# EAGLE board electrobassrev9_fix (EAGLE 9.6.2), part 1 of 2
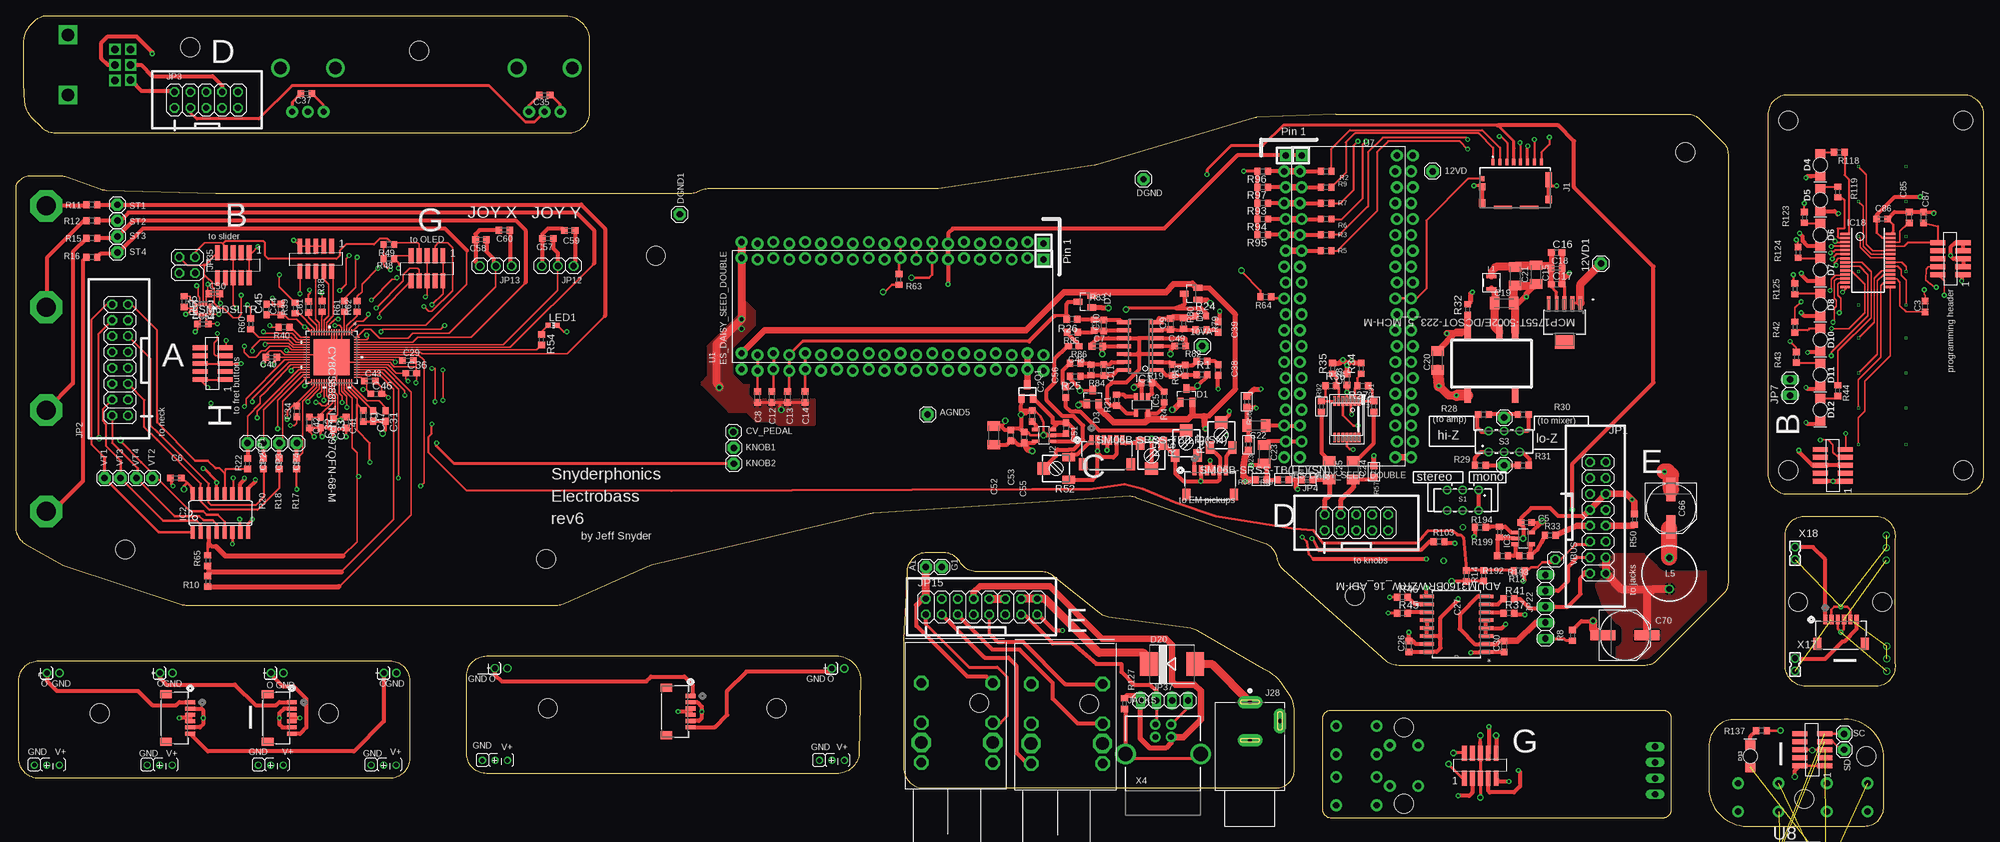
[diagram p12: board, top side]
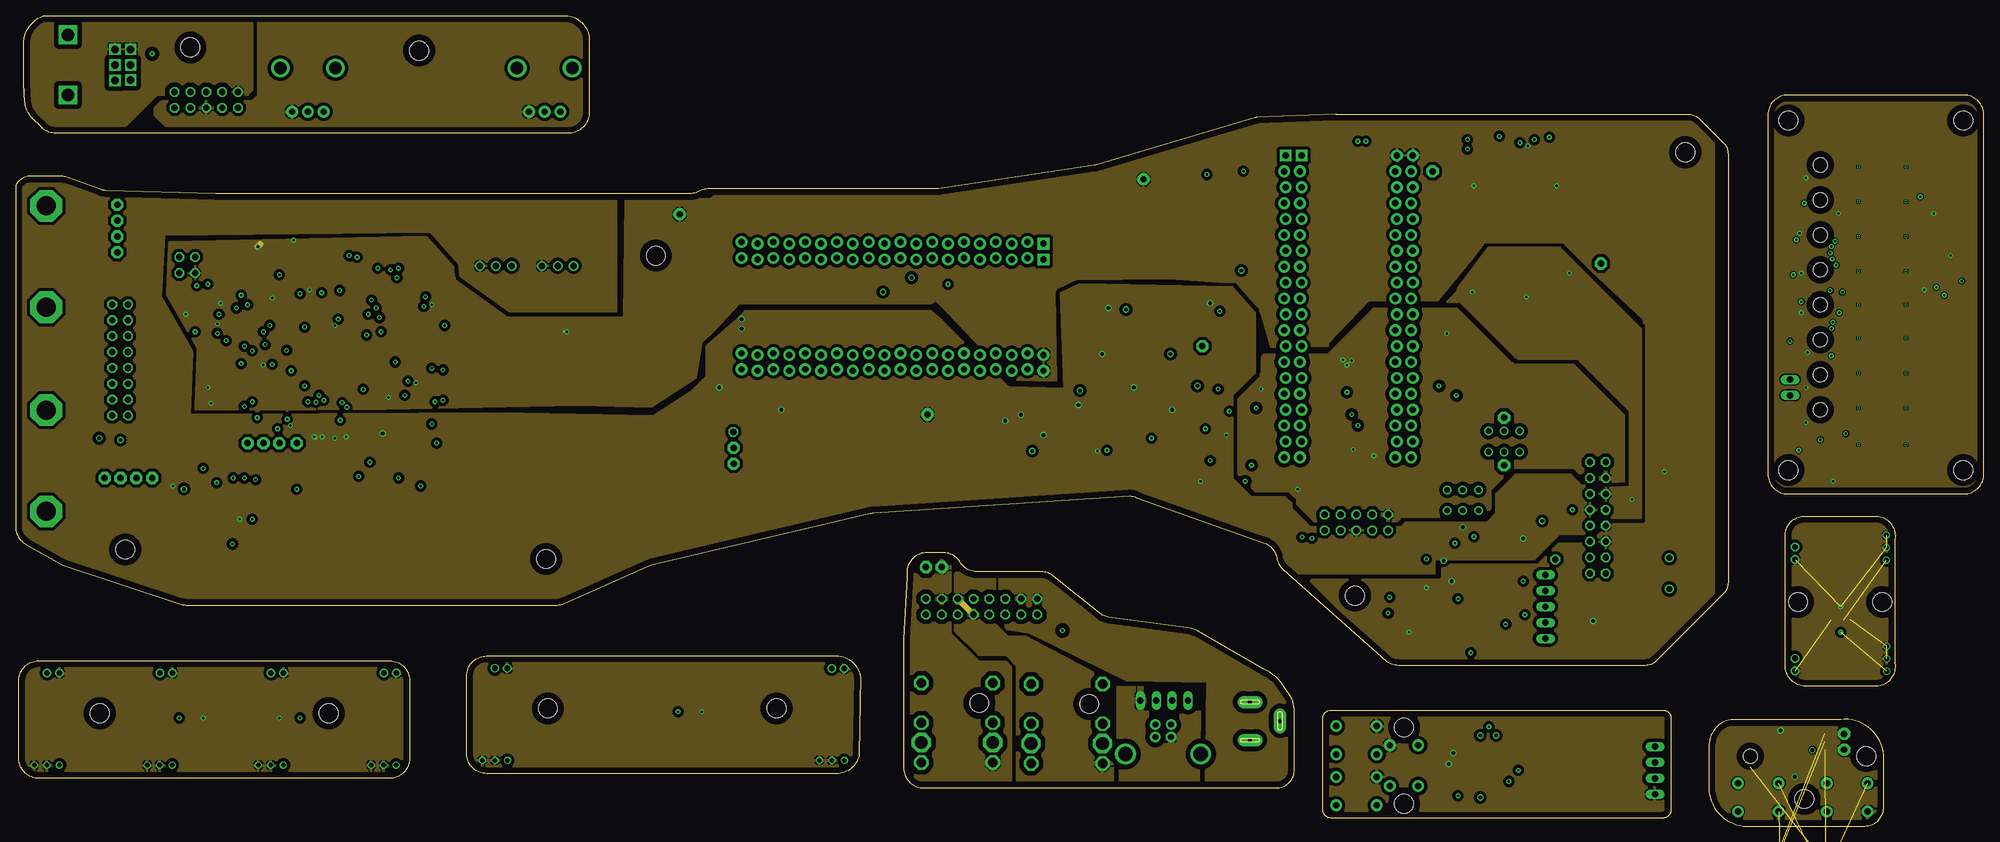
[diagram p13: board, inner layer Route2]
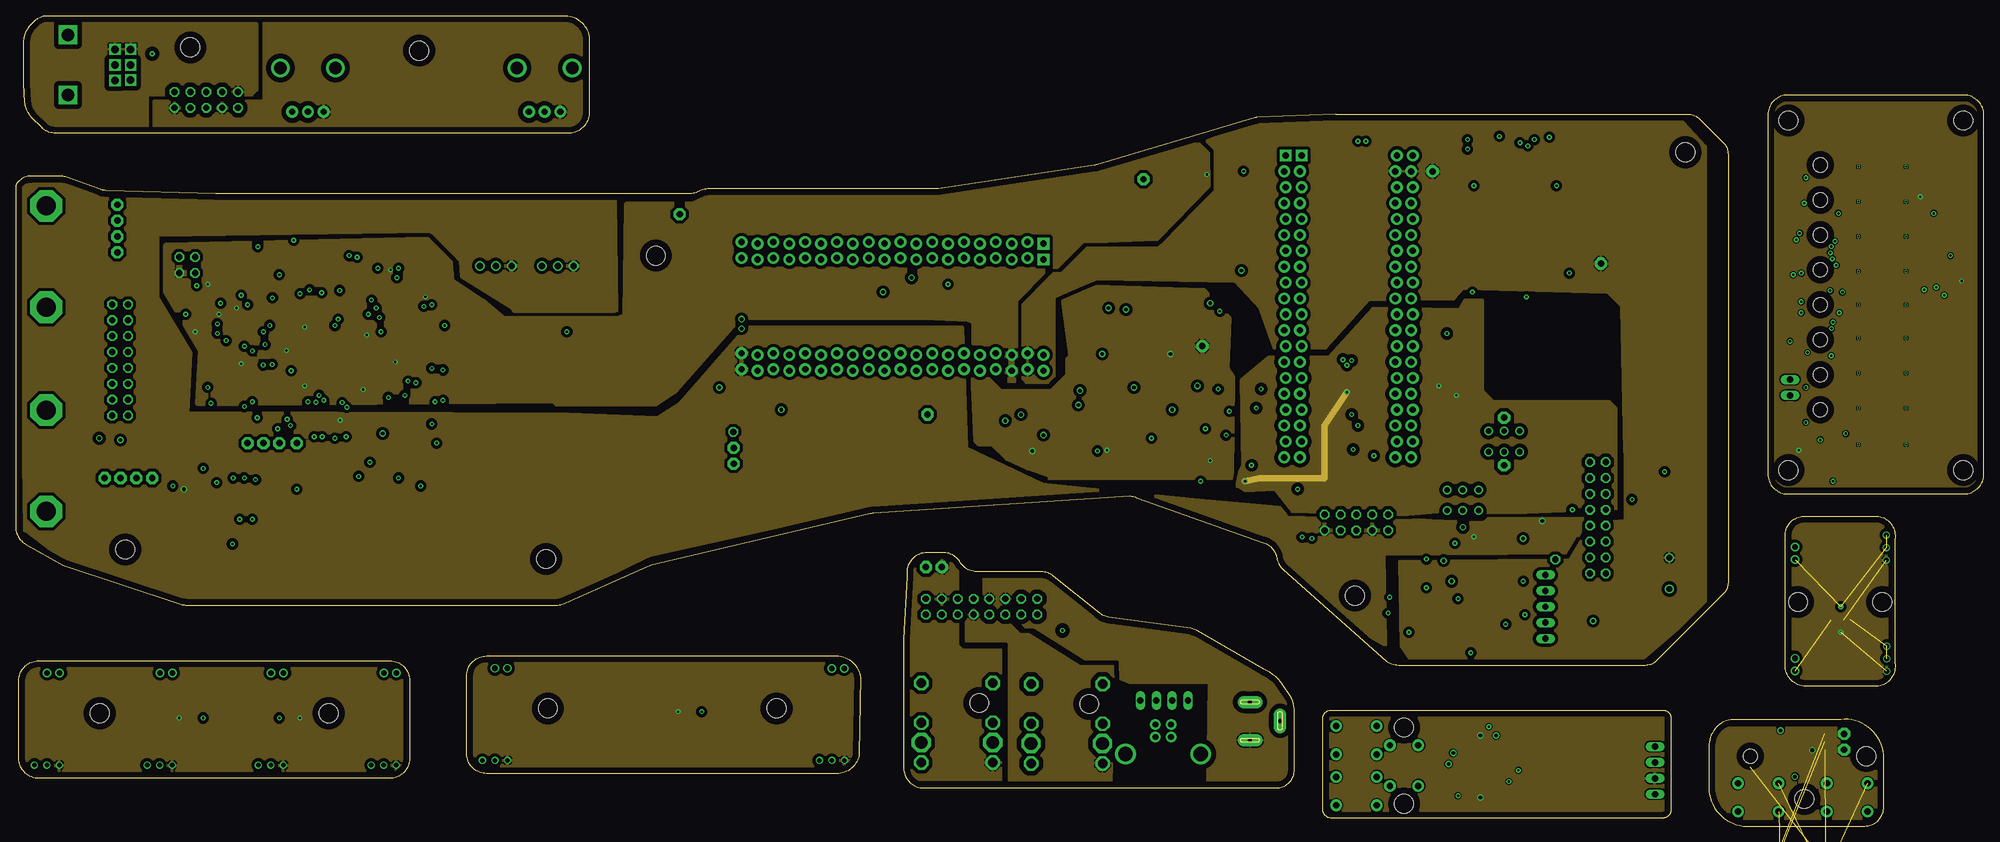
[diagram p14: board, inner layer Route15]
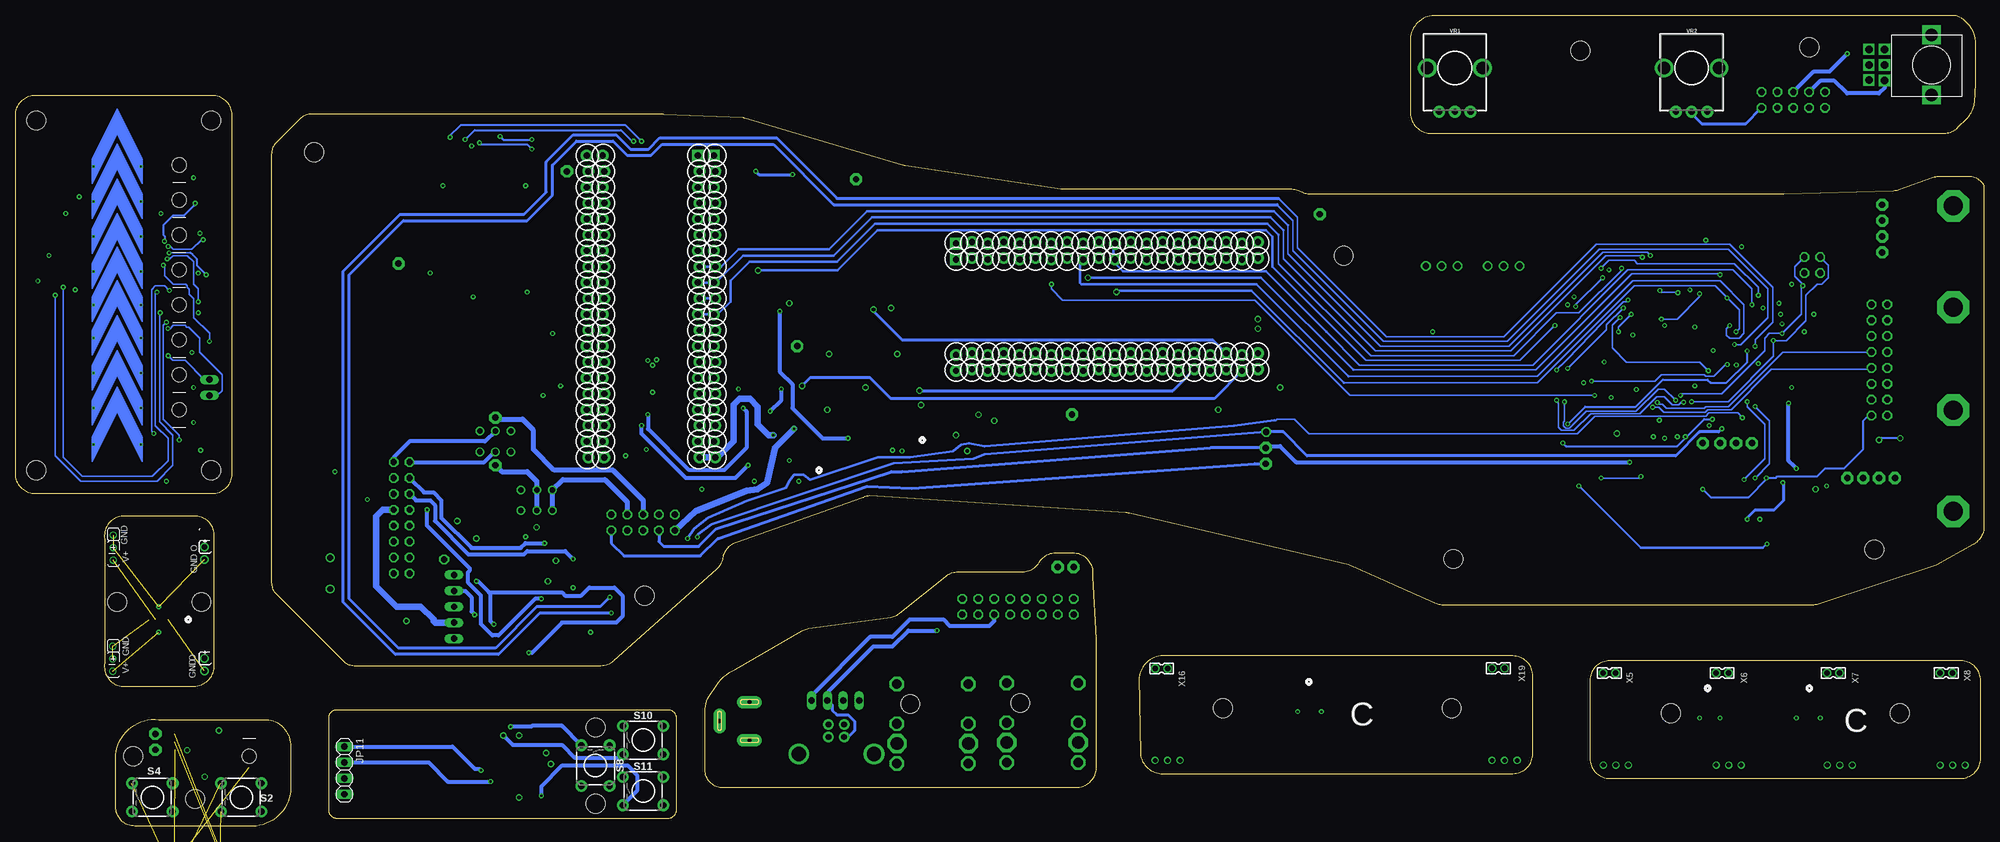
[diagram p15: board, bottom side, seen from below]

Size 314.71 x 129.54 mm. Coordinates in mm from the lower left corner, seen from the top.
Outline: 0,102.36 0,47.82 arc60 1.61,45.06 7.62,41.66 26.44,35.46 arc18 27.43,35.31 86.45,35.31 arc24 87.74,35.58 101.07,41.53 arc-11 101.64,41.73 136.64,49.98 arc-10 137.18,50.05 178.16,52.79 arc-23 179.43,52.36 199.52,45.28 arc-58 201.56,43.26 201.7,42.64 arc35 202.69,40.98 219.06,26.45 arc42 221.17,25.65 260.57,25.65 arc45 262.36,26.4 273.07,37.1 arc45 273.81,38.9 273.81,107.41 arc45 273.07,109.2 269.22,113.05 arc45 267.43,113.79 211.07,113.79 198.37,113.28 arc-9 198.13,113.21 172.93,105.73 arc-8 172.5,105.63 147.55,101.89 arc-9 147.08,101.85 110.89,101.85 arc23 109.64,101.6 109.06,101.35 arc-23 107.81,101.09 32,101.09 14.48,101.59 arc-18 13.49,101.77 8.14,103.7 arc20 7.07,103.89 2.47,103.89 arc63 0,102.36
Outline: 311.53,116.84 283.34,116.84 arc90 280.16,113.66 280.16,56.26 arc90 283.34,53.09 311.53,53.09 arc90 314.71,56.26 314.71,113.66 arc90 311.53,116.84
Outline: 291.85,17.02 275,17.02 arc90 270.76,13.03 270.76,6.78 arc90 276.27,0 295.66,0 arc90 298.7,3.05 298.7,11.43 arc90 291.85,17.02
Outline: 4.62,129.52 88.27,129.54 arc-90 91.69,125.09 91.69,113.92 arc-90 88.27,110.74 6.39,110.74 arc-45 4.15,111.67 2.65,113.17 arc-18 2.06,114 1.81,114.5 arc-22 1.48,115.69 1.27,118.62 1.27,125.03 arc-70 4.38,129.49 4.53,129.53 arc-20 4.62,129.52
Outline: 210.31,18.54 263.4,18.54 arc-90 264.67,17.27 264.67,2.54 arc-90 263.4,1.27 210.31,1.27 arc-90 209.04,2.54 209.04,17.27 arc-90 210.31,18.54
Outline: 142.49,39.88 141.99,29.97 141.99,9.27 arc90 145.16,6.1 201.8,6.1 arc90 204.47,9.27 204.47,18.27 arc28 203.85,20.76 202.63,22.52 arc34 199.56,25.1 188.98,31.21 arc21 187.89,31.57 175.26,33.27 174.75,33.38 arc-27 173.39,34.01 165.97,39.94 arc39 163.99,40.64 153.72,40.64 arc-60 150.97,42.22 arc60 148.41,43.69 145.67,43.69 arc90 142.49,40.51 142.49,39.88
Outline: 130.94,8.38 75.31,8.38 arc-90 72.14,11.56 72.14,24 arc-90 75.31,27.18 130.43,27.18 arc-90 135.13,23.75 134.87,11.56 arc-90 130.94,8.38
Outline: 282.96,26.03 282.96,46.36 arc-90 285.88,49.53 297.81,49.53 arc-90 300.48,45.85 300.48,26.03 arc-90 297.81,22.35 285.88,22.35 arc-90 282.96,26.03
Outline: 59.82,7.62 3.68,7.62 arc-90 0.51,10.79 0.51,23.24 arc-90 3.68,26.42 59.82,26.42 arc-90 62.99,23.24 62.99,10.79 arc-90 59.82,7.62
Copper layers (1+2*15+16): Top 0.035mm / dielectric 1.5mm / Route2 0.035mm / dielectric 0.15mm / Route15 0.035mm / dielectric 0.2mm / Bottom 0.035mm
Design rules "default *": minimum track width 8mil, minimum drill 12mil, track to track 7mil, track to pad 7mil, pad to pad 7mil, via to via 7mil, smd to smd 7mil, copper to edge 40mil, drill to drill 8mil, minimum pad ring 1mil, minimum via ring 8mil, stop-mask expansion 1mil, vias tented up to drill 0mil, thermal gap 10mil
Holes 3.05 mm at 84.84,42.67 17.53,44.2 102.36,91.19 214.12,36.83 266.95,107.7 311.4,112.78 311.4,56.9 283.46,56.9 283.46,112.78 286,4.32 295.91,11.18 64.52,123.95 27.94,124.46 222,15.75 222,3.56 85.09,18.8 121.67,18.8 298.45,35.81 284.99,35.81 13.46,18.03 50.04,18.03

## Footprints (pad centres in the part's own frame; a part is rotated, then mirrored left to right if it is on the bottom)
1X01 = drill 1.016 pad 1.93 octagon: 1 0,0
C0603K = smd 1.05 x 1.08: 1 -0.875,0; 2 0.875,0
C1206K = smd 1.5 x 2: 1 -1.5,0; 2 1.5,0
C0603 = smd 1.1 x 1: 1 -0.85,0; 2 0.85,0
PANASONIC_E = smd 3.8 x 1.4: + 3,0; - -3,0
PANASONIC_F = smd 4 x 1.6: + 3.55,0; - -3.55,0
1X01' = drill 1.016 octagon: 1 0,0
SOT23 = smd 1 x 1.4: 1 -0.95,-1.1; 2 0.95,-1.1; 3 0,1.1
LED-1206-BOTTOM = smd 1.5 x 1.6: A -1.8,0; C 1.8,0 | hole 2.3: 0,0
SMC = smd 2.8 x 3.8: A 3.7,0; C -3.7,0
SO14 = smd 0.6 x 2.2: 1 -3.81,-2.6; 2 -2.54,-2.6; 3 -1.27,-2.6; 4 0,-2.6; 5 1.27,-2.6; 6 2.54,-2.6; 7 3.81,-2.6; 8 3.81,2.6; 9 2.54,2.6; 10 1.27,2.6; 11 0,2.6; 12 -1.27,2.6; 13 -2.54,2.6; 14 -3.81,2.6
SO16 = smd 0.66 x 2.032: 1 -4.445,-3.073; 2 -3.175,-3.073; 3 -1.905,-3.073; 4 -0.635,-3.073; 5 0.635,-3.073; 6 1.905,-3.073; 7 3.175,-3.073; 8 4.445,-3.073; 9 4.445,3.073; 10 3.175,3.073; 11 1.905,3.073; 12 0.635,3.073; 13 -0.635,3.073; 14 -1.905,3.073; 15 -3.175,3.073; 16 -4.445,3.073
SOT23-5 = smd 0.6 x 1.2: 1 -0.95,-1.306; 2 0,-1.306; 3 0.95,-1.306; 4 0.95,1.306; 5 -0.95,1.306
SSOP28 = smd 0.4 x 1.5: 1 -4.225,-3.625; 2 -3.575,-3.625; 3 -2.925,-3.625; 4 -2.275,-3.625; 5 -1.625,-3.625; 6 -0.975,-3.625; 7 -0.325,-3.625; 8 0.325,-3.625; 9 0.975,-3.625; 10 1.625,-3.625; 11 2.275,-3.625; 12 2.925,-3.625; 13 3.575,-3.625; 14 4.225,-3.625; 15 4.225,3.625; 16 3.575,3.625; 17 2.925,3.625; 18 2.275,3.625; 19 1.625,3.625; 20 0.975,3.625; 21 0.325,3.625; 22 -0.325,3.625; 23 -0.975,3.625; 24 -1.625,3.625; 25 -2.275,3.625; 26 -2.925,3.625; 27 -3.575,3.625; 28 -4.225,3.625
105162-0001 = smd 0.5 x 1: 1 3.55,-7.34; 2 2.45,-7.34; 3 1.35,-7.34; 4 0.25,-7.34; 5 -0.85,-7.34; 6 -1.95,-7.34; 7 -3.05,-7.34; 8 -4.15,-7.34 | smd 0.72 x 0.78: 9 5.31,-4.66 | smd 1.05 x 1.08: 10 5.325,-3.39 | smd 1.05 x 1.2: 11 5.325,-0.78; 12 -5.325,-1.35 | smd 1.05 x 2.39: 13 -5.325,-4.535 | smd 2.91 x 0.55: 14 1.986,-0.105; 15 -2.204,-0.105
CONN_SM06B-SRSS-TB_JST = smd 0.66 x 1.549: 1 -2.5,2.507; 2 -1.5,2.507; 3 -0.5,2.507; 4 0.5,2.507; 5 1.5,2.507; 6 2.5,2.507 | smd 1.295 x 1.905: 7 -3.8,-1.368; 8 3.8,-1.368
CUI_PJ-066A = drill 0.7 pad 2 long: 1 0,0; 2 6.1,0; 3 3,4.8
2X08 = drill 1.016 octagon: 1 -8.89,-1.27; 2 -8.89,1.27; 3 -6.35,-1.27; 4 -6.35,1.27; 5 -3.81,-1.27; 6 -3.81,1.27; 7 -1.27,-1.27; 8 -1.27,1.27; 9 1.27,-1.27; 10 1.27,1.27; 11 3.81,-1.27; 12 3.81,1.27; 13 6.35,-1.27; 14 6.35,1.27; 15 8.89,-1.27; 16 8.89,1.27
2X05 = drill 1.016 octagon: 1 -5.08,-1.27; 2 -5.08,1.27; 3 -2.54,-1.27; 4 -2.54,1.27; 5 0,-1.27; 6 0,1.27; 7 2.54,-1.27; 8 2.54,1.27; 9 5.08,-1.27; 10 5.08,1.27
20021121 = smd 0.76 x 2.4: 1 -2.54,-2; 2 -2.54,2; 3 -1.27,-2; 4 -1.27,2; 5 0,-2; 6 0,2; 7 1.27,-2; 8 1.27,2; 9 2.54,-2; 10 2.54,2
1X02 = drill 1.016 long: 1 -1.27,0; 2 1.27,0
1X04 = drill 1.016 long: 1 -3.81,0; 2 -1.27,0; 3 1.27,0; 4 3.81,0
1X03 = drill 1.016: 1 -2.54,0; 2 0,0; 3 2.54,0
1X05 = drill 1.016 long: 1 -5.08,0; 2 -2.54,0; 3 0,0; 4 2.54,0; 5 5.08,0
2X02 = drill 1.016 octagon: 1 -1.27,-1.27; 2 -1.27,1.27; 3 1.27,-1.27; 4 1.27,1.27
BOURNS_SRP2010 = smd 0.559 x 1.6: P$1 -1.003,0; P$2 1.003,0
6000-XXXX-RC = drill 0.9 pad 1.422: 1 -2.5,0; 2 2.5,0
CHIP-LED0603 = smd 0.8 x 0.8: A 0,-0.75; C 0,0.75
SUPER-SOT3 = smd 1 x 1.4: 1 -0.95,-1.1; 2 0.95,-1.1; 3 0,1.1
R0603 = smd 1 x 1.1: 1 -0.85,0; 2 0.85,0
RTRIM3314J = smd 1.3 x 2: 1 1.8,-2; 3 -1.8,-2 | smd 2 x 2: 2 0,2
452404020202 = drill 0.9: 1 2.5,1.65; 2 0,1.65; 3 -2.5,1.65; 4 2.5,-1.65; 5 0,-1.65; 6 -2.5,-1.65
TACTILE_SWITCH_PTH_6.0MM = drill 1.016 pad 1.88: 1 -3.251,2.261; 2 3.251,2.261; 3 -3.251,-2.261; 4 3.251,-2.261
ES_DAISY_SEED_DOUBLE = drill 1.016 pad 1.88 square: 1 -7.493,24.13; B1 -10.033,24.13 | drill 1.016 pad 1.88: 2 -7.747,21.59; 3 -7.493,19.05; 4 -7.747,16.51; 5 -7.493,13.97; 6 -7.747,11.43; 7 -7.493,8.89; 8 -7.747,6.35; 9 -7.493,3.81; 10 -7.747,1.27; 11 -7.493,-1.27; 12 -7.747,-3.81; 13 -7.493,-6.35; 14 -7.747,-8.89; 15 -7.493,-11.43; 16 -7.747,-13.97; 17 -7.493,-16.51; 18 -7.747,-19.05; 19 -7.493,-21.59; 20 -7.747,-24.13; 21 7.493,-24.13; 22 7.747,-21.59; 23 7.493,-19.05; 24 7.747,-16.51; 25 7.493,-13.97; 26 7.747,-11.43; 27 7.493,-8.89; 28 7.747,-6.35; 29 7.493,-3.81; 30 7.747,-1.27; 31 7.493,1.27; 32 7.747,3.81; 33 7.493,6.35; 34 7.747,8.89; 35 7.493,11.43; 36 7.747,13.97; 37 7.493,16.51; 38 7.747,19.05; 39 7.493,21.59; 40 7.747,24.13; B2 -10.287,21.59; B3 -10.033,19.05; B4 -10.287,16.51; B5 -10.033,13.97; B6 -10.287,11.43; B7 -10.033,8.89; B8 -10.287,6.35; B9 -10.033,3.81; B10 -10.287,1.27; B11 -10.033,-1.27; B12 -10.287,-3.81; B13 -10.033,-6.35; B14 -10.287,-8.89; B15 -10.033,-11.43; B16 -10.287,-13.97; B17 -10.033,-16.51; B18 -10.287,-19.05; B19 -10.033,-21.59; B20 -10.287,-24.13; B21 10.033,-24.13; B22 10.287,-21.59; B23 10.033,-19.05; B24 10.287,-16.51; B25 10.033,-13.97; B26 10.287,-11.43; B27 10.033,-8.89; B28 10.287,-6.35; B29 10.033,-3.81; B30 10.287,-1.27; B31 10.033,1.27; B32 10.287,3.81; B33 10.033,6.35; B34 10.287,8.89; B35 10.033,11.43; B36 10.287,13.97; B37 10.033,16.51; B38 10.287,19.05; B39 10.033,21.59; B40 10.287,24.13
SOT25 = smd 0.55 x 1.2: 1 -0.95,-1.3; 2 0,-1.3; 3 0.95,-1.3; 4 0.95,1.3; 5 -0.95,1.3
SOT-223_5_MCH-M = smd 0.61 x 2.159: 1 -2.54,-3.109; 2 -1.27,-3.109; 3 0,-3.109; 4 1.27,-3.109; 5 2.54,-3.109 | smd 3.15 x 2.159: 6 0,3.109
QFN-68-M = smd 0.914 x 0.203: 1 -4,3.2; 2 -4,2.8; 3 -4,2.4; 4 -4,2; 5 -4,1.6; 6 -4,1.2; 7 -4,0.8; 8 -4,0.4; 9 -4,0; 10 -4,-0.4; 11 -4,-0.8; 12 -4,-1.2; 13 -4,-1.6; 14 -4,-2; 15 -4,-2.4; 16 -4,-2.8; 17 -4,-3.2; 35 4,-3.2; 36 4,-2.8; 37 4,-2.4; 38 4,-2; 39 4,-1.6; 40 4,-1.2; 41 4,-0.8; 42 4,-0.4; 43 4,0; 44 4,0.4; 45 4,0.8; 46 4,1.2; 47 4,1.6; 48 4,2; 49 4,2.4; 50 4,2.8; 51 4,3.2 | smd 0.203 x 0.914: 18 -3.2,-4; 19 -2.8,-4; 20 -2.4,-4; 21 -2,-4; 22 -1.6,-4; 23 -1.2,-4; 24 -0.8,-4; 25 -0.4,-4; 26 0,-4; 27 0.4,-4; 28 0.8,-4; 29 1.2,-4; 30 1.6,-4; 31 2,-4; 32 2.4,-4; 33 2.8,-4; 34 3.2,-4; 52 3.2,4; 53 2.8,4; 54 2.4,4; 55 2,4; 56 1.6,4; 57 1.2,4; 58 0.8,4; 59 0.4,4; 60 0,4; 61 -0.4,4; 62 -0.8,4; 63 -1.2,4; 64 -1.6,4; 65 -2,4; 66 -2.4,4; 67 -2.8,4; 68 -3.2,4 | smd 5.791 x 5.791: 69 0,0
RW_16_ADI-M = smd 2.286 x 0.559: 1 -4.737,4.445; 2 -4.737,3.175; 3 -4.737,1.905; 4 -4.737,0.635; 5 -4.737,-0.635; 6 -4.737,-1.905; 7 -4.737,-3.175; 8 -4.737,-4.445; 9 4.737,-4.445; 10 4.737,-3.175; 11 4.737,-1.905; 12 4.737,-0.635; 13 4.737,0.635; 14 4.737,1.905; 15 4.737,3.175; 16 4.737,4.445
QFN_6DSLTR_STM = smd 0.584 x 0.356: 1 -1.156,0.75; 2 -1.156,0.25; 3 -1.156,-0.25; 4 -1.156,-0.75; 8 1.156,-0.75; 9 1.156,-0.25; 10 1.156,0.25; 11 1.156,0.75 | smd 0.356 x 0.584: 5 -0.5,-0.914; 6 0,-0.914; 7 0.5,-0.914; 12 0.5,0.914; 13 0,0.914; 14 -0.5,0.914
SOP65P780X200-20N = smd 1.676 x 0.432: 1 -3.607,2.921; 2 -3.607,2.286; 3 -3.607,1.626; 4 -3.607,0.965; 5 -3.607,0.33; 6 -3.607,-0.33; 7 -3.607,-0.965; 8 -3.607,-1.626; 9 -3.607,-2.286; 10 -3.607,-2.921; 11 3.607,-2.921; 12 3.607,-2.286; 13 3.607,-1.626; 14 3.607,-0.965; 15 3.607,-0.33; 16 3.607,0.33; 17 3.607,0.965; 18 3.607,1.626; 19 3.607,2.286; 20 3.607,2.921
TSSOP-14 = smd 0.45 x 1.5: 1 -1.95,-2.9; 2 -1.3,-2.9; 3 -0.65,-2.9; 4 0,-2.9; 5 0.65,-2.9; 6 1.3,-2.9; 7 1.95,-2.9; 8 1.95,2.9; 9 1.3,2.9; 10 0.65,2.9; 11 0,2.9; 12 -0.65,2.9; 13 -1.3,2.9; 14 -1.95,2.9
SLIDERS_SLIDER-SEGMENT3 = drill 0.254 pad 0.406 square: P$1 -1.27,3.81; P$2 -1.27,-3.81
PN092 = drill 2 square: P$1 -4.8,0; P$2 4.8,0 | drill 1.2 square: P$3 -2.5,-7.5; P$4 0,-7.5; P$5 2.5,-7.5; P$6 -2.5,-10; P$7 0,-10; P$8 2.4,-10
XP_POWER_ISEXXXXA = smd 1 x 2.28: P$1 -3.81,-5.08; P$2 -1.27,-5.08; P$4 3.81,-5.08; P$5 3.81,5.08; P$8 -3.81,5.08
STRING_HOLDER = drill 3.048 pad 5.08 octagon: P$1 0,0
POT-PTH-ALPS-KIT = drill 1 pad 1.88: P$1 7,-2.5; P$2 7,0; P$3 7,2.5 | drill 2: P$4 0,-4.4; P$5 0,4.4
3P-2MM-TH = drill 0.75: P$1 -2,0; P$2 0,0; P$3 2,0
NRJ6HF2 = drill 2.057 octagon: POST1 -7.442,0; POST2 -7.442,-11.43 | drill 1.524 octagon: R -10.6,0; RN -10.6,-11.43; S -4.25,0; SN -4.25,-11.43; T -16.942,0; TN -16.942,-11.43 | hole 2.997: -13.792,-2.134
USB-B-PTH = drill 0.914 pad 1.676: D+ 0,1.25; D- 1.981,1.25; GND 0,-1.25; VBUS 1.981,-1.25 | drill 2.286: S1 -2.718,-6.02; S2 -2.718,6.02
332-02 = drill 0.9 pad 1.27: 1 0,-1; 2 0,1

## Placement (x,y rotation side)
10VA  [1X01]  189.74,76.71 90 top
12VD  [1X01]  226.57,104.65 270 top
12VD1  [1X01]  253.49,89.92 90 top
A1  [1X01]  145.54,41.4 0 top
AGND5  [1X01]  145.8,65.79 0 top
AUDIO_OUT_L_POSTVOL  [1X01]  238,65.28 0 top
AUDIO_OUT_R_POSTVOL  [1X01]  238,57.66 0 top
C1  .01uf  [C0603K]  55.63,65.53 270 top
C2  .01uf  [C0603K]  162.56,65.53 90 top
C3  2200pf  [C0603K]  305.31,83.06 90 top
C4  560pf  [C0603K]  184.91,72.9 270 top
C5  .1uf  [C0603K]  241.55,48.51 180 top
C6  .1uf  [C0603K]  25.65,55.63 180 top
C7  .1uf  [C0603K]  172.97,76.71 0 top
C8  .01uf  [C0603K]  118.62,68.58 270 top
C9  560pf  [C0603K]  184.66,80.26 90 top
C10  560pf  [C0603K]  173.99,80.01 90 top
C11  560pf  [C0603K]  173.99,72.9 270 top
C12  .01uf  [C0603K]  120.9,68.58 270 top
C13  .01uf  [C0603K]  123.44,68.58 270 top
C14  .01uf  [C0603K]  126.24,68.58 270 top
C15  10uf  [C1206K]  243.08,88.14 270 top
C16  1uf  [C0603]  246.38,91.69 0 top
C17  .001uf  [C0603]  246.38,86.61 0 top
C18  .01uf  [C0603K]  246.38,89.15 0 top
C19  10uf  [C1206K]  238,83.57 0 top
C20  10uf  [C1206K]  227.33,74.42 90 top
C21  10uf  [C1206K]  239.78,87.88 270 top
C22  10uf  [C1206K]  198.37,64.01 180 top
C23  10uf  [C1206K]  199.64,59.44 270 top
C24  10uf  [C1206K]  213.87,56.9 270 top
C25  10uf  [C1206K]  210.06,56.9 270 top
C26  .1uf  [C0603K]  222.76,28.7 90 top
C27  .1uf  [C0603K]  231.96,39.99 270 top
C28  .1uf  [C0603K]  212.85,71.37 90 top
C29  2200pf  [C0603K]  62.74,74.42 0 top
C30  .1uf  [C0603K]  238,28.7 90 top
C31  1uf  [C0603]  59.18,65.53 270 top
C32  1uf  [C0603]  48.77,64.52 270 top
C33  1uf  [C0603]  50.8,64.26 270 top
C34  .01uf  [C0603K]  44.96,66.29 270 top
C35  .1uf  [C0603K]  84.58,116.84 180 top
C36  1uf  [C0603]  63.25,72.39 0 top
C37  .1uf  [C0603K]  46.48,117.09 180 top
C38  1uf  [C0603]  192.28,72.9 90 top
C39  1uf  [C0603]  192.28,79.76 270 top
C40  .1uf  [C0603K]  40.89,74.93 180 top
C41  .1uf  [C0603K]  52.83,64.52 270 top
C42  .1uf  [C0603K]  46.99,64.52 270 top
C43  .1uf  [C0603K]  56.64,71.12 0 top
C44  .1uf  [C0603K]  42.42,82.55 90 top
C45  1uf  [C0603]  40.13,82.55 90 top
C46  1uf  [C0603]  57.66,69.09 0 top
C47  1uf  [C0603]  57.15,65.53 270 top
C48  1uf  [C0603]  169.16,76.71 0 top
C49  .1uf  [C0603K]  186.21,76.74 0 top
C50  .1uf  [C0603K]  31.75,85.09 0 top
C51  1uf  [C0603]  167.93,63.6 270 top
C52  10uf  [C1206K]  156.37,62.45 90 top
C53  1uf  [C0603]  159.1,62.45 90 top
C54  .1uf  [C0603K]  29.97,80.26 0 top
C55  .001uf  [C0603]  161.26,62.13 90 top
C56  1uf  [C0603]  167.89,69.34 90 top
C57  .01uf  [C0603K]  85.09,93.92 180 top
C58  .01uf  [C0603K]  74.42,93.73 180 top
C59  .1uf  [C0603K]  88.58,95.19 180 top
C60  .1uf  [C0603K]  78.17,95.25 180 top
C61  2200pf  [C0603K]  46.84,82.98 90 top
C66  47uf  [PANASONIC_E]  264.67,50.8 270 top
C70  100uf  [PANASONIC_F]  257.3,30.48 0 top
C85  .1uf  [C0603K]  302.77,97.28 90 top
C86  .1uf  [C0603K]  298.45,97.03 0 top
C87  .1uf  [C0603K]  305.05,97.28 90 top
CP1  [1X01]  37.08,61.21 0 top
CP2  [1X01]  39.62,61.21 0 top
CP3  [1X01]  42.16,61.21 0 top
CP4  [1X01]  44.96,61.21 0 top
CV_PEDAL  [1X01']  114.74,62.99 0 top
D1  BAT54S  [SOT23]  187.2,68.83 0 top
D2  BAT54S  [SOT23]  170.94,83.82 90 top
D3  BAT54S  [SOT23]  172.21,68.58 0 top
D4  [LED-1206-BOTTOM]  288.54,105.66 270 top
D5  [LED-1206-BOTTOM]  288.54,100.08 270 top
D6  [LED-1206-BOTTOM]  288.54,94.49 270 top
D7  [LED-1206-BOTTOM]  288.54,88.9 270 top
D8  [LED-1206-BOTTOM]  288.54,83.31 270 top
D9  BAT54S  [SOT23]  187.96,85.09 90 top
D10  [LED-1206-BOTTOM]  288.54,77.72 270 top
D11  [LED-1206-BOTTOM]  288.54,72.14 270 top
D12  [LED-1206-BOTTOM]  288.54,66.55 270 top
D13  [LED-1206-BOTTOM]  277.37,11.18 90 top
D20  MBRS340T3  [SMC]  184.91,25.91 0 top
DGND  [1X01]  180.34,103.38 270 top
DGND1  [1X01]  106.17,97.79 90 top
G1  [1X01]  148.08,41.4 0 top
IC1  LMV324M  [SO14]  179.83,76.71 90 top
IC2  4052D  [SO16]  32.77,50.04 0 top
IC3  LMV321M5  [SOT23-5]  241.05,45.97 270 top
IC5  LMV321M5  [SOT23-5]  180.09,67.31 180 top
IC18  CY8C4124  [SSOP28]  296.16,90.42 270 top
J1  105162-0001  [105162-0001]  239.78,98.81 180 top
J2  SM06B-SRSS-TB(LF)(SN)  [CONN_SM06B-SRSS-TB_JST]  174.5,59.18 0 top
J3  SM06B-SRSS-TB(LF)(SN)  [CONN_SM06B-SRSS-TB_JST]  191.01,54.36 0 top
J5  SM06B-SRSS-TB(LF)(SN)  [CONN_SM06B-SRSS-TB_JST]  291.85,30.48 0 top
J6  SM06B-SRSS-TB(LF)(SN)  [CONN_SM06B-SRSS-TB_JST]  105.41,18.29 270 top
J7  SM06B-SRSS-TB(LF)(SN)  [CONN_SM06B-SRSS-TB_JST]  25.4,17.27 270 top
J8  SM06B-SRSS-TB(LF)(SN)  [CONN_SM06B-SRSS-TB_JST]  41.66,17.27 270 top
J28  PJ-066A  [CUI_PJ-066A]  197.36,19.81 270 top
JP1  [2X08]  252.98,49.28 270 top
JP2  [2X08]  16.71,74.5 90 top
JP3  PINHD-2X5  [2X05]  30.48,116.08 0 top
JP4  PINHD-2X5  [2X05]  214.38,48.51 0 top
JP5  20021121  [20021121]  48.01,90.68 180 top
JP6  20021121  [20021121]  290.58,57.66 90 top
JP7  [1X02]  283.72,70.1 90 top
JP8  20021121  [20021121]  34.8,89.66 180 top
JP9  20021121  [20021121]  65.79,89.15 180 top
JP10  20021121  [20021121]  234.19,9.65 0 top
JP11  PINHD-1X4  [1X04]  262.13,8.89 270 bottom
JP12  [1X03]  86.68,89.53 180 top
JP13  [1X03]  76.77,89.53 180 top
JP15  [2X08]  154.43,35.05 0 top
JP22  PINHD-1X5  [1X05]  244.6,35.05 270 top
JP23  20021121  [20021121]  31.5,73.91 90 top
JP24  20021121  [20021121]  287.27,12.19 90 top
JP34  20021121  [20021121]  309.37,90.68 90 top
JP35  [2X02]  27.43,89.66 270 top
JP37  [1X04]  183.64,20.07 0 top
KNOB1  [1X01]  114.81,60.45 0 top
KNOB2  [1X01]  114.81,57.91 0 top
L1  2.2uH  [BOURNS_SRP2010]  235.97,86.87 270 top
L5  [6000-XXXX-RC]  264.41,40.39 90 top
LED1  [CHIP-LED0603]  85.85,80.01 270 top
Q1  DMP3099L  [SUPER-SOT3]  161.77,69.44 0 top
R1  10k  [R0603]  189.69,72.16 0 top
R2  47R  [R0603]  209.55,104.65 0 top
R3  47R  [R0603]  209.55,94.49 0 top
R4  10k  [R0603]  183.64,68.58 90 top
R5  47R  [R0603]  209.55,91.95 0 top
R6  47R  [R0603]  209.55,97.03 0 top
R7  47R  [R0603]  209.55,99.57 0 top
R8  0R  [R0603]  248.92,30.48 90 top
R9  47R  [R0603]  209.55,102.11 0 top
R10  0R  [R0603]  30.73,39.12 90 top
R11  0R  [R0603]  12.19,99.31 180 top
R12  0R  [R0603]  12.19,96.77 180 top
R13  33k  [R0603]  240.41,40.83 0 top
R14  68k  [R0603]  234.73,40.01 90 top
R15  0R  [R0603]  12.19,93.98 180 top
R16  0R  [R0603]  12.19,90.93 180 top
R17  0R  [R0603]  44.96,57.91 90 top
R18  0R  [R0603]  42.16,57.91 90 top
R19  10k  [R0603]  180.85,70.87 180 top
R20  0R  [R0603]  39.62,57.91 90 top
R21  1.6k  [R0603]  176.02,68.07 90 top
R22  0R  [R0603]  37.08,57.91 90 top
R23  2M  [R0603]  197.1,60.96 270 top
R24  10k  [R0603]  189.48,81.53 0 top
R25  10k  [R0603]  169.42,71.88 180 top
R26  10k  [R0603]  168.91,81.03 180 top
R27  20k  [R0603]  215.39,70.36 180 top
R28  10k  [R0603]  234.7,65.79 180 top
R29  10k  [R0603]  234.19,57.66 180 top
R30  47R  [R0603]  241.05,65.79 0 top
R31  47R  [R0603]  241.05,57.66 0 top
R32  5R_DNP  [R0603]  232.16,82.55 90 top
R33  47R  [R0603]  245.36,46.48 0 top
R34  10k  [R0603]  215.14,73.15 90 top
R35  10k  [R0603]  210.57,73.15 90 top
R36  20k  [R0603]  210.31,70.36 0 top
R37  22R  [R0603]  238.76,34.04 0 top
R38  47R  [R0603]  49.02,83.06 90 top
R39  47R  [R0603]  44.7,82.8 90 top
R40  47R  [R0603]  42.93,79.76 180 top
R41  22R  [R0603]  238.76,36.32 0 top
R42  82R  [R0603]  284.48,79.76 270 top
R43  82R  [R0603]  284.73,74.93 270 top
R44  82R  [R0603]  291.34,69.6 270 top
R45  22R  [R0603]  221.74,34.04 0 top
R46  22R  [R0603]  221.74,36.58 0 top
R47  [RTRIM3314J]  192.79,62.48 0 top
R48  1.6k  [R0603]  59.69,90.68 180 top
R49  1.6k  [R0603]  59.69,92.96 180 top
R50  5R  [R0603]  258.83,49.02 90 top
R51  [RTRIM3314J]  181.61,59.18 180 top
R52  [RTRIM3314J]  166.37,57.15 90 top
R53  [RTRIM3314J]  187.2,61.21 0 top
R54  82R  [R0603]  84.07,77.72 270 top
R55  0R  [R0603]  26.92,83.82 270 top
R56  2M  [R0603]  196.85,67.82 270 top
R57  2M  [R0603]  217.17,56.64 270 top
R60  47R  [R0603]  37.59,80.26 90 top
R61  47R  [R0603]  52.58,83.06 90 top
R62  47R  [R0603]  54.61,83.06 90 top
R63  47R  [R0603]  141.22,87.38 270 top
R64  47R  [R0603]  199.9,84.58 180 top
R65  1.6k  [R0603]  30.73,42.42 90 top
R79  10k  [R0603]  189.55,79.31 180 top
R80  10k  [R0603]  186.75,80.33 90 top
R81  10k  [R0603]  187.01,72.83 270 top
R82  10k  [R0603]  189.67,74.29 0 top
R83  10k  [R0603]  172.47,80.07 90 top
R84  10k  [R0603]  171.96,72.9 270 top
R85  10k  [R0603]  168.97,78.93 180 top
R86  10k  [R0603]  169.42,73.98 180 top
R88  2M  [R0603]  199.14,55.37 180 top
R89  2M  [R0603]  202.69,55.37 180 top
R90  2M  [R0603]  206.5,55.37 0 top
R91  100R  [R0603]  217.17,67.06 90 top
R92  100R  [R0603]  208.79,67.06 90 top
R93  47k  [R0603]  199.39,99.57 180 top
R94  47k  [R0603]  199.39,97.03 180 top
R95  47k  [R0603]  199.39,94.49 180 top
R96  47k  [R0603]  199.39,104.65 180 top
R97  47k  [R0603]  199.39,102.11 180 top
R103  0R  [R0603]  227.58,45.47 180 top
R118  82R  [R0603]  291.59,107.7 180 top
R119  82R  [R0603]  291.34,101.35 90 top
R123  82R  [R0603]  286,97.28 270 top
R124  82R  [R0603]  284.99,91.69 270 top
R125  82R  [R0603]  284.48,85.85 270 top
R127  0R  [R0603]  177.29,19.56 90 top
R137  560R  [R0603]  279.15,15.24 0 top
R192  10k  [R0603]  237.74,43.18 0 top
R193  10k  [R0603]  241.3,43.18 180 top
R194  10k  [R0603]  234.19,47.75 180 top
R199  10k  [R0603]  237.24,46.99 90 top
S1  [452404020202]  231.39,52.07 0 top
S2  MOMENTARY-SWITCH-SPST-PTH-6.0MM  [TACTILE_SWITCH_PTH_6.0MM]  278.64,4.57 0 bottom
S3  [452404020202]  238,61.47 180 top
S4  MOMENTARY-SWITCH-SPST-PTH-6.0MM  [TACTILE_SWITCH_PTH_6.0MM]  292.86,4.57 0 bottom
S8  MOMENTARY-SWITCH-SPST-PTH-6.0MM  [TACTILE_SWITCH_PTH_6.0MM]  222,9.65 270 bottom
S10  MOMENTARY-SWITCH-SPST-PTH-6.0MM  [TACTILE_SWITCH_PTH_6.0MM]  214.38,13.72 0 bottom
S11  MOMENTARY-SWITCH-SPST-PTH-6.0MM  [TACTILE_SWITCH_PTH_6.0MM]  214.38,5.59 0 bottom
SC  [1X01]  292.35,14.73 0 top
SD  [1X01]  292.35,12.19 0 top
ST1  [1X01]  16.26,99.31 0 top
ST2  [1X01]  16.26,96.77 0 top
ST3  [1X01]  16.26,94.23 0 top
ST4  [1X01]  16.26,91.69 0 top
U1  ES_DAISY_SEED_DOUBLE  [ES_DAISY_SEED_DOUBLE]  140.21,83.06 270 top
U2  LP2985  [SOT25]  164.43,62.45 90 top
U3  MCP1755T-5002E/DCSOT-223_5_MCH-M  [SOT-223_5_MCH-M]  247.65,80.52 180 top
U4  CY8C5888LTI-LP097QFN-68-M  [QFN-68-M]  50.55,74.93 270 top
U5  ADUM3160BRWZRW_16_ADI-M  [RW_16_ADI-M]  230.38,32.26 180 top
U6  LSM6DSLTR  [QFN_6DSLTR_STM]  29.97,82.55 0 top
U7  ES_DAISY_SEED_DOUBLE  [ES_DAISY_SEED_DOUBLE]  213.11,83.06 0 top
U8  MCP23008T-E/SS  [SOP65P780X200-20N]  285.75,-6.35 0 top  (outside the outline)
U10  OPA1654  [TSSOP-14]  212.85,65.02 180 top
U$1  SLIDER_SEGMENT  [SLIDERS_SLIDER-SEGMENT3]  298.45,106.68 90 bottom
U$2  PN092  [PN092]  8.38,121.67 270 bottom
U$5  SLIDER_SEGMENT  [SLIDERS_SLIDER-SEGMENT3]  298.45,101.09 90 bottom
U$9  POWER_ISOLATE  [XP_POWER_ISEXXXXA]  235.97,73.91 180 top
U$11  SLIDER_SEGMENT  [SLIDERS_SLIDER-SEGMENT3]  298.45,95.5 90 bottom
U$12  SLIDER_SEGMENT  [SLIDERS_SLIDER-SEGMENT3]  298.45,89.92 90 bottom
U$13  SLIDER_SEGMENT  [SLIDERS_SLIDER-SEGMENT3]  298.45,84.58 90 bottom
U$14  SLIDER_SEGMENT  [SLIDERS_SLIDER-SEGMENT3]  298.45,79.25 90 bottom
U$15  STRING_HOLDER  [STRING_HOLDER]  4.89,82.93 0 top
U$16  STRING_HOLDER  [STRING_HOLDER]  4.89,99.12 0 top
U$18  SLIDER_SEGMENT  [SLIDERS_SLIDER-SEGMENT3]  298.45,73.66 90 bottom
U$19  SLIDER_SEGMENT  [SLIDERS_SLIDER-SEGMENT3]  298.45,68.07 90 bottom
U$20  SLIDER_SEGMENT  [SLIDERS_SLIDER-SEGMENT3]  298.45,62.23 90 bottom
U$68  STRING_HOLDER  [STRING_HOLDER]  4.89,66.48 0 top
U$69  STRING_HOLDER  [STRING_HOLDER]  4.89,50.29 0 top
VBUS  [1X01']  246.19,42.61 0 top
VR1  B100k  [POT-PTH-ALPS-KIT]  84.58,121.16 270 bottom
VR2  B100k  [POT-PTH-ALPS-KIT]  46.74,121.16 270 bottom
VT1  [1X01]  14.22,55.63 0 top
VT2  [1X01]  21.84,55.63 0 top
VT3  [1X01]  16.76,55.63 0 top
VT4  [1X01]  19.3,55.63 0 top
X1  3P-2MM-TH-MALE  [3P-2MM-TH]  130.51,10.49 180 bottom
X2  NRJ6HF2  [NRJ6HF2]  156.24,5.91 270 top
X3  NRJ6HF2  [NRJ6HF2]  173.8,5.75 270 top
X4  USB+SHIELD  [USB-B-PTH]  183.48,14.22 90 top
X5  332-02  [332-02]  59.88,24.46 90 bottom
X6  332-02  [332-02]  41.85,24.44 90 bottom
X7  332-02  [332-02]  24.07,24.44 90 bottom
X8  332-02  [332-02]  6.03,24.46 90 bottom
X9  3P-2MM-TH-MALE  [3P-2MM-TH]  58.84,9.74 180 bottom
X10  3P-2MM-TH-MALE  [3P-2MM-TH]  40.81,9.74 180 bottom
X11  3P-2MM-TH-MALE  [3P-2MM-TH]  23.03,9.74 180 bottom
X12  3P-2MM-TH-MALE  [3P-2MM-TH]  4.99,9.74 180 bottom
X13  3P-2MM-TH-MALE  [3P-2MM-TH]  299.19,26.75 270 bottom
X14  3P-2MM-TH-MALE  [3P-2MM-TH]  299.11,44.5 270 bottom
X15  3P-2MM-TH-MALE  [3P-2MM-TH]  76.63,10.49 180 bottom
X16  332-02  [332-02]  131.47,25.17 90 bottom
X17  332-02  [332-02]  284.53,25.81 180 top
X18  332-02  [332-02]  284.53,43.59 180 top
X19  332-02  [332-02]  77.62,25.22 90 bottom
X20  3P-2MM-TH-MALE  [3P-2MM-TH]  93.47,212.85 0 top  (outside the outline)
X21  3P-2MM-TH-MALE  [3P-2MM-TH]  110.49,212.85 0 top  (outside the outline)
X22  332-02  [332-02]  94.49,199.14 90 top  (outside the outline)
X23  332-02  [332-02]  111.51,199.14 90 top  (outside the outline)

## Tracks (layer width: path | path; a pad name or v marks a point on that pad's centre or on a via)
1.5V_MID
  Top 0.406: 179.58,75.69 179.58,75.44
  Top 0.61: IC5.4 177.58,66 176.36,67.22 R21.1 175.09,67.22 174.5,67.82 174.5,70.1 175.26,70.87 177.55,70.87 179.58,72.9 179.58,75.44 IC1.12 | 179.58,77.98 179.58,75.69 | 179.58,75.69 179.83,75.44 IC1.3 | 179.58,75.69 179.32,75.44 | 174.77,77.98 174.75,77.96 | 174.75,77.96 173.23,77.96 173.21,77.98 172.97,77.98 172.1,77.1 C7.1 | C49.2 187.09,77.83 186.94,77.98 IC1.5 179.58,77.98 | 174.75,77.96 IC1.10 179.58,77.98
3V3A1  (via drill 0.35, 0.6)
  Top 0.203: U4.44 50.95,69.41 51.45,68.9 51.45,65.77 C33.1 | 52.07,65.39 C41.1
  Top 0.305: C33.1 51.79,65.11 | 52.07,65.39 51.79,65.11 | 51.79,65.11 51.79,64.97 v51.89,64.87
  Top 0.406: IC2.16 28.07,53.37 28.07,54.23 | C6.1 26.67,55.63 27.43,54.86
  Top 0.508: 28.07,54.23 27.43,54.86 26.92,54.36 v26.92,53.85
  Top 0.61: C59.1 89.46,89.77 JP12.1 | C60.1 79.04,89.8 JP13.1 | IC5.5 182.59,66 183.64,67.06 R4.1 | IC3.5 244.07,48.65 | v244.09,48.77 243.34,48.38 C5.1 | R194.2 233.34,46.39 v233.17,46.23
  Top 0.813: D1.2 188.15,65.7 188.32,65.53 189.99,65.53 190.75,65.53 195.07,69.85 195.07,81.79 190.82,86.04 D9.2 | D2.2 172.04,85.34
  Top 1.016: D3.2 173.16,66.87 175.51,64.52 180.59,64.52 181.04,64.96 181.04,65.02 | 181.04,65.02 IC5.5 | D1.2 188.15,65.72 187.45,65.02 181.04,65.02 | D9.2 188.81,86.04 188.19,86.65 185.17,86.61 183.9,85.34 172.04,85.34 167.64,85.34 161.54,79.25 119.76,79.25 U1.21 | v244.09,48.77 244.07,48.65 | v190.25,63.5 189.99,65.53
  Bottom 1.016: JP4.1 205.99,50.29 197.87,53.59 196.09,53.85 194.56,54.86 193.29,60.45 v190.25,63.5
  pour Route15 (isolate 0.508, rank 4): 186.18,47.75 136.4,51.05 101.09,43.18 86.61,36.07 26.92,35.81 7.62,42.67 1.52,47.24 0.76,102.36 7.11,103.12 14.22,100.33 95.77,100.07 96.02,82.3 79.71,82.3 79.63,82.66 71.42,87.79 71.24,90.26 66.34,95.11 22.61,94.42 22.61,84.56 27.92,75.7 27.45,66 33.02,66.04 88.33,65.79 102.72,65.25 106.23,67.51 115.62,78.18 116.84,79.76 151.3,79.76 151.92,60.39 164.1,54.64 189.2,52.07 226.31,48.77 234.7,48.51 235.47,49.1 251.11,49.09 248.43,43.72 218.69,43.43 218.95,28.96
3V3D3  (via drill 0.6)
  Top 0.508: JP10.6 JP10.5 v234.19,4.57 | 234.19,13.46 v234.19,14.48
  Top 0.61: JP10.6 234.19,13.46
  pour Route15: 209.55,18.54 264.16,18.54 264.16,1.52 209.55,1.52
3V3D5  (via drill 0.35)
  Top 0.406: IC18.27 298.43,94 297.6,94.83 C86.1
  Top 0.61: JP34.1 311.15,87.92 v311.15,87.12 | C86.1 297.6,97.7 300.48,100.58 v304.55,100.58 | JP6.5 JP6.6 287.27,57.66 285.12,59.82 v285.12,60.07
  pour Route15: 314.96,116.84 314.96,56.26 311.79,53.09 280.42,53.09 280.42,116.59 280.16,116.84
3V3FORPEDAL
  Top 1.016: JP1.9 249.6,48.01 R33.2
5V0
  Top 0.508: C17.1 245.53,86.19 246.38,85.34 U3.4
  Top 0.813: C16.1 245.53,89.89 245.27,89.64 | C18.1 245.5,86.64 C17.1
  Top 1.016: 236.47,89.15 235.97,88.65 L1.P$1 | C15.1 245.02,89.64 | 245.02,89.64 245.27,89.64 | 245.02,89.64 C18.1
  Top 1.27: 236.47,89.15 236.7,89.38 C21.1 240.03,89.64 C15.1
12VD1
  Top 0.508: U3.2 U3.1
  Top 1.016: Q1.3 161.8,70.6 U1.B39 U1.39
  Top 1.27: C66.+ 264.41,47.55 | 12VD1.1 250.19,86.61 U3.1
  Top 2.54: L5.2 264.41,47.55
  pour Route15 (isolate 0.508, rank 3): 190.25,109.47 191.77,107.95 191.77,101.6 182.63,92.46 169.93,92.46 160.78,83.31 160.78,71.63 161.54,70.87 165.1,70.87 166.12,71.88 166.12,84.54 170.5,86.44 172.85,87.41 194.98,87.01 198.98,82.68 201.18,76.37 209.47,76.37 216.41,84.07 229.97,84.2 231.48,85.89 254.53,85.22 256.72,83.02 257.22,59.77 257.3,59.69 257.3,48.86 252.73,48.53 252.73,46.23 250.7,46.23 248.55,42.64 244.86,42.42 244.93,42.49 244.93,42.57 221.22,42.34 221.49,28.7 223.27,26.16 259.59,26.16 270.26,35.27 270.26,108.69 265.69,113.6 198.37,112.78
12VD2
  Top 1.27: D20.C 181.1,26.02 181.1,26.92 180.34,27.69 173.23,27.69 164.59,36.32 JP15.16 JP15.14
  pour Route2 (isolate 0.762): 157.48,40.13 164.21,40.13 173.48,32.77 187.96,30.73 201.93,23.37 204.98,17.82 204.71,6.09 190.5,5.96 190.72,23.14 177.77,23.35 162.31,30.96 158.75,31.5 157.48,32.77
12VIN
  Top 1.27: L5.1 261.87,37.89 | 261.87,37.89 260.85,36.86 C70.+ | JP1.14 JP1.16 256.75,37.89 261.87,37.89
  pour Top (isolate 1.016): 252.73,43.43 260.35,43.43 263.42,40.64 270.26,40.64 270.26,35.05 261.62,27.43 260.1,26.16 256.03,26.16 256.03,32.51 253.75,35.31 252.73,38.35
+3V3  (via drill 0.35)
  Top 0.203: 56.13,69.76 C46.1 | 56.13,69.76 56.13,70.75 C43.1 55.16,71.73 U4.52 | JP8.5 JP8.6 | U4.35 46.84,70.93 46.27,70.36 v46.23,70.36 | U4.59 60.34,74.53 v60.71,74.17 | U4.17 46.52,79.76 v46.23,79.76 44.96,81.03 43.69,81.03 43.04,81.67 C44.1 42.39,81.7 C45.1 | U4.24 43.6,75.73 v43.31,76.03 | U6.5 29.47,80.64 C54.1 29.1,79.39 v28.7,78.99 | U6.12 30.47,84.69 C50.1 30.73,85.23 v30.73,86.61 | U6.8 31.14,81.79 v32.51,81.79 | U4.67 56.14,77.73 56.39,77.98 56.39,78.23 | 56.13,69.76 55.71,69.76 55.63,69.85 v55.56,69.79
  Top 0.254: 56.39,78.23 v56.13,78.49 | R49.2 R48.2 58.84,89.75 59.69,88.9 v59.94,88.9 | JP9.5 JP9.6 65.79,84.84 v65.53,84.58 | JP8.6 34.8,83.31 v35.31,82.8
  Top 0.305: JP23.6 JP23.5 v36.07,73.91
  Top 0.508: 239.52,108.23 239.52,108.46 239.53,108.45 J1.4 239.53,109.47 236.98,112.01 202.69,112.01 199.39,108.71 194.31,108.71 190.5,104.9 v190.5,104.14 | R96.2 v196.34,104.65
  Top 0.61: R95.2 R94.2 R93.2 R97.2 R96.2 | C26.1 225.63,27.83 | 225.63,27.83 U5.16 | U5.12 U5.13 U5.14 227.46,30.35 227.84,29.97 | 225.63,27.83 227.22,27.83 227.84,28.45 227.84,29.97 | 227.84,29.97 227.84,33.27 230.63,36.07 v230.63,36.32 | v248.92,50.55 248.92,57.91 261.87,70.87 261.87,89.41 249.17,102.11 249.17,109.47 246.63,112.01 236.98,112.01
  Bottom 0.508: v196.34,104.65 195.83,104.14 v190.5,104.14
  Bottom 0.61: v230.63,36.32 231.65,36.32 237.49,30.48 238.51,30.48 240.28,32.26 240.28,36.83 242.32,38.86 242.32,40.64 242.06,40.89 242.06,41.15 248.92,48.01 v248.92,50.55
  pour Route15 (isolate 0.508): 65.79,93.73 24.1,92.72 24.09,85.38 29.68,76.01 29.21,67.56 86.23,68.04 86.51,67.56 102.29,67.56 105.39,69.61 115.77,81.29 144.98,81.43 152.36,81.09 153.34,80.7 153.34,77.14 158.75,71.37 159.77,71.37 159.77,84.07 164.59,88.9 165.86,88.9 170.69,93.73 174.39,93.73 182.46,94.04 190.59,102.33 190.48,107.47 188.72,109.22 171.31,106.57 118.11,100.33 110.49,100.33 108.2,99.31 97.8,99.31 97.56,81.52 96.33,81.03 77.79,81.03 77.72,81.28 74.68,83.82 69.6,87.12 69.41,90.1
+5V_ISOL  (via drill 0.35)
  Top 0.406: v212.85,69.34 U10.4
  Top 0.61: C28.1 v212.85,69.34
  Top 1.016: R88.2 197.1,55.37 | R23.2 196.6,58.93 196.34,57.4 196.34,55.88 197.1,55.37 | 197.1,55.37 v196.6,55.12
  Top 1.27: v227.58,70.36 229.11,68.83 v230.38,68.83
  Top 1.778: C20.1 v227.58,70.36 | U$9.P$5 v230.38,68.83
  Route15 1.016: v196.6,55.12 198.88,55.63 209.3,55.63 209.3,64.01 v212.85,69.34
  pour Route15 (isolate 0.61, rank 2): 231.84,84.07 234.44,84.07 234.44,69.6 236.22,67.82 254.76,67.82 255.78,66.8 255.78,50.55 251.71,50.55 241.48,50.18 234.91,50.04 228.35,50.29 221.74,49.78 204.22,50.29 201.42,53.85 196.6,53.59 195.33,54.36 195.83,56.64 196.34,57.66 196.09,71.37 200.41,74.93 210.06,74.93 217.17,82.8 230.89,82.55
+10V  (via drill 0.35, 0.6)
  Top 0.406: J2.3 174.75,61.69
  Top 0.61: 185.31,76.71 C49.1 | C52.1 158.49,60.95 159.1,61.56 C53.1 159.63,61.6 160.27,60.96 160.93,60.96 C55.1 162.92,61.29 U2.5 | C49.1 184.66,76.06 v184.66,75.44 | J3.3 191.01,56.86 | 191.01,56.86 J3.4 | 191.01,56.86 v191.01,58.42 | J2.3 174.5,61.69 v174.5,60.07 174.5,60 | 174.75,61.69 J2.4 | IC1.4 C49.1
  Top 1.016: C55.1 161.8,60.2 v162.56,59.94
  pour Route15 (isolate 0.508, rank 5): 189.99,85.69 194.06,81.28 193.77,73.19 194.61,71.91 194.44,55.63 165.61,55.63 165.35,55.37 165.35,55.88 161.8,57.15 158.5,58.67 156.21,60.96 154.04,60.96 153.46,61.54 152.91,74.13 157.44,69.6 165.61,69.6 168.15,72.14 168.15,74.68 168.66,75.18 167.47,84.1 172.46,86.31
ADC1_1  (via drill 0.6)
  Top 0.406: U1.B22 C8.1
  Top 0.508: U1.22 U1.B22 | v188.98,70.36 188.55,69.93
  Top 0.61: R1.2 190.54,71.92 v188.98,70.36 | 188.55,69.93 D1.3
  Bottom 0.508: U1.B22 123.06,68.33 174.75,68.33 178.05,71.63 187.71,71.63 v188.98,70.36
ADC1OPAMPOUT
  Top 0.406: R81.2 187.18,72.16 | IC1.1 183.13,72.9
  Top 0.61: 183.13,72.9 184.05,71.98 R81.2 186.97,72.02 C4.2 | 187.18,72.16 R1.1
ADC2_1  (via drill 0.6)
  Top 0.406: U1.B23 121.16,69.71 C12.1
  Top 0.508: U1.23 U1.B23 | 185.5,82.8 177.8,82.8 v177.55,82.55
  Top 0.61: D9.3 186.86,83.33 185.5,82.8 189.58,82.8 190.33,82.05 R24.2
  Bottom 0.508: v177.55,82.55 177.55,82.3 172.97,77.72 123.32,77.72 U1.23
ADC2BYPASS
  Top 0.203: C47.1 54.91,68.62 53.35,70.19 U4.50
ADC2OPAMPOUT
  Top 0.61: R80.2 182.84,81.18 IC1.7 | R80.2 187.11,81.53 185.05,81.53 C9.2 | R24.1 188.28,81.18 R80.2
ADC3_1
  Top 0.406: U1.B24 123.7,72.64 123.7,69.71 C13.1
  Top 0.508: 168.23,81.53 166.12,81.53 | 162.05,77.47 125.86,77.47 U1.24 123.7,72.64
  Top 0.61: 166.12,81.53 162.05,77.47 | 169.69,83.97 D2.3 169.43,83.73 168.32,83.74 168.06,83.48 R26.2 168.06,81.36 168.23,81.53
ADC3OPAMPOUT
  Top 0.406: R83.2 173.95,80.92 C10.2
  Top 0.61: 176.28,80.92 R83.2 172.47,81.03 R26.1 | 176.28,80.92 176.57,80.92 | 176.28,80.92 IC1.8
ADC4_1  (via drill 0.6)
  Top 0.406: U1.B25 126.24,72.64 C14.1
  Top 0.508: U1.25 126.24,72.64 | D3.3 172.13,69.6 v170.18,69.6
  Top 0.61: R25.2 168.57,71.53 170.18,69.91 v170.18,69.6
  Bottom 0.508: U1.B25 129.67,69.6 v170.18,69.6
ADC4OPAMPOUT
  Top 0.406: IC1.14 176.28,72.9
  Top 0.61: 174.01,72.05 R84.2 171.79,71.88 R25.1 | 176.28,72.9 175.43,72.05 174.01,72.05 | C11.2 174.01,72.05
ADCBYPASS
  Top 0.203: U4.51 53.75,70.46 56.23,67.97 58.1,67.97 59.18,66.89 C31.1
AGND  (via drill 0.35, 0.6)
  Top 0.203: U4.43 50.55,69.15 51.05,68.64 51.05,67.06 49.78,65.79 49.78,63.67 | 50.04,63.67 50.04,63.41 | v43.94,64.01 44.56,64.01 44.96,64.4 C34.2 | C1.2 55.65,64.68 C47.2
  Top 0.406: U2.2 165.76,62.48 164.85,62.48 164.34,62.99 164.34,64.55 163.83,65.53 163.07,66.29 161.04,66.29 160.82,66.51 Q1.1 | C55.2 161.8,62.98 162.31,62.48 v164.34,62.48 | C32.2 47.01,63.67 C42.2 46.99,62.99 v47.75,62.23 | C32.2 49.78,63.67 50.04,63.67 | 50.04,63.41 C33.2 | C33.2 52.6,63.41 C41.2 v52.83,62.23 | C1.2 59.16,64.66 C31.2 59.18,63.25 v58.67,62.74 | C33.2 50.8,62.23 v51.05,61.98 | C32.2 48.77,62.48 v49.02,62.23
  Top 0.508: IC2.7 35.94,48.9 v35.81,49.02 | C6.2 24.89,55.51 24.89,54.61 v25.15,54.36 | C8.2 C12.2 122.17,67.7 | 122.17,67.7 C13.2 C14.2 | 122.17,67.7 122.17,66.8 v122.43,66.55 | 157.48,64.01 157.73,64.01 158.24,64.52 v158.24,64.77 | 156.46,64.01 155.7,64.01 155.76,63.95 C52.2 | C17.2 247.65,86.19 U3.3
  Top 0.61: JP13.3 73.55,90.22 C58.2 73.55,94.63 74.17,95.25 C60.2 | C59.2 87.39,95.5 85.09,95.5 84.22,94.63 C57.2 84.22,89.61 JP12.3 | IC5.2 180.09,70.78 R19.2 179.49,70.36 178.82,70.36 v178.82,70.1 | v160.75,65.75 160.75,63.49 C55.2 161.04,62.98 160.53,63.5 159.3,63.5 C53.2 158.19,63.3 157.48,64.01 156.46,64.01 | 161.54,66.04 161.75,66.25 162.4,66.25 C2.2 160.89,66.41 160.78,66.29 Q1.1 | C51.2 167.66,62.48 165.76,62.48 | R192.1 236.89,45.8 R199.1 237.4,45.97 IC3.2 v241.05,45.97 241.05,47.86 240.63,48.27 240.63,48.47 C5.2 240.68,49.16 242.32,50.8 245.36,50.8 246.63,49.53 250.7,49.53 | 192.53,56.84 192.53,55.37 192.28,55.12 v189.48,55.12 | 192.53,56.84 J3.5 | J3.2 189.51,55.14 v189.48,55.12 | J2.2 172.97,61.66 v172.97,59.94 172.97,59.69 | J2.5 176,59.41 175.51,58.93 173.74,58.93 172.97,59.69 | R47.3 192.53,58.94 192.53,56.84 | v189.48,55.12 186.69,55.12 185.4,56.41 R53.3 185.38,59.21 R51.3 | R52.3 172.19,55.35 172.97,56.13 172.97,59.69 | C7.2 IC1.11
  Top 0.813: D9.1 189.13,84.07 190.5,84.07 v191.01,83.57 | v174.75,82.8 173.94,82.8 173.74,82.79 173.63,82.87 D2.1 | v173.74,75.44 173.74,76.59 C7.2 | 161.54,66.04 161.04,66.04 v160.75,65.75 | 164.85,62.48 v164.34,62.48 | C16.2 247.23,89.18 C18.2 | C15.2 241.55,85.11 241.55,84.84 | 241.55,84.84 v241.55,84.58 | v248.41,88.39 247.23,87.21 C17.2 | R32.2 232.66,83.91 232.66,85.09 v232.92,85.34 | C19.2 240.28,83.57 241.55,84.84
  Top 1.016: D3.1 170.28,67.48 v169.93,67.31 | D1.1 186.25,67.63 185.17,66.55 v184.91,66.55 | C18.2 247.25,86.64 C17.2 | R50.2 258.83,51.82 v258.44,52.2 257.56,53.09 JP1.6 JP1.7 250.7,49.53
  Top 1.27: U1.B20 U1.20 v116.08,81.03 112.01,76.96 112.01,70.87 112.52,70.36 v112.52,70.1 | U$9.P$1 239.78,83.29 C19.2 239.5,86.11 C21.2 242.82,86.38 C15.2
  Route2 0.406: v47.75,62.23 48.01,61.98
  Bottom 1.016: U7.20 U7.B20 202.44,58.93 199.9,61.47 199.9,67.31 198.93,68.28 197.31,68.28 196.09,67.06 196.09,64.26 194.31,62.48 v193.55,62.48
  other vias: 228.35,42.42 231.39,47.75 116.08,79.5
  pour Route2 (isolate 0.508): 78.99,82.26 96.05,82.26 96.05,100.86 16,101.09 8.38,103.63 0.76,103.63 0,45.72 6.86,41.91 27.18,35.56 87.12,35.56 101.85,41.91 136.4,50.55 185.17,46.99 197.21,46.8 203.63,40.39 226.82,40.39 226.82,42.67 242.82,42.67 246.89,46.74 252.22,46.74 252.22,47.24 254.25,49.28 259.84,49.28 259.84,79.5 246.89,92.46 235.46,92.46 230.63,85.85 230.63,85.6 228.85,83.82 230.89,83.82 239.78,74.93 240.03,74.93 240.28,74.68 249.68,74.68 258.06,66.29 258.06,54.2 255.59,54.1 252.98,54.1 252.73,54.36 250.44,54.36 248.67,56.13 239.78,56.13 236.73,53.09 236.73,50.04 235.2,48.51 222.25,48.51 221.49,47.75 207.01,47.75 203.96,50.8 203.96,51.56 202.95,52.58 197.61,52.58 194.56,55.63 194.56,68.83 198.16,72.43 198.16,82.06 194.56,86.11 170.16,86.63 167.11,85.19 167.7,69.89 158.75,70.1 148.08,80.77 146.3,82.3 116.59,82.3 116.59,82.22 115.33,80.96 110.49,76.71 110.49,71.88 107.92,69.31 102.03,65.47 81.18,65.88 80.23,66.01 32.77,65.78 27.87,65.71 28.27,75.81 23.2,84.58 23.73,94.49 66.29,95.02 70.96,89.73 71.05,87.93
  pour Top: 115.82,93.47 115.82,81.79 110.74,76.71 110.74,71.88 109.73,70.87 109.73,70.61 114.05,66.29 116.84,66.29 118.36,64.77 121.41,64.77 121.92,64.26 127.76,64.26 127.76,68.07 117.86,68.07 117.09,68.83 117.09,70.1 117.35,70.36 116.33,70.36 114.55,72.14 114.55,76.45 118.11,80.01 118.11,82.3 116.84,83.57 116.59,83.57 116.59,93.47
AGND3
  Route2 1.016: JP15.7 JP15.6
  pour Route15 (isolate 0.762): 158.88,6.39 158.88,6.5 175.34,6.5 175.58,22.41 175.59,22.49 175.53,25.58 170.16,25.58 162.05,30.73 160.55,30.73 160.55,30.71 154.43,36.83 154.43,37.85 151.89,37.85 151.89,29.46 158.5,29.46 158.75,29.21 158.75,6.79
  pour Route2 (isolate 0.762): 150.37,40.39 156.46,40.39 156.46,32.26 158.53,30.19 161.41,30.19 175.26,22.86 175.26,6.1 160.27,6.1 160.27,25.65 158.5,27.43 154.18,27.43 150.37,31.24
AGND4
  pour Route2 (isolate 0.762): 142.75,42.93 149.35,42.93 149.35,30.73 153.92,26.16 158.24,26.16 159,25.4 159,6.6 158.24,5.84 143.76,5.84 142.49,7.11 142.49,42.67
  pour Route15 (isolate 0.61): 142.75,43.94 150.62,43.94 150.62,28.96 151.38,28.19 157.48,28.19 157.48,7.37 141.99,7.37 141.99,43.18
AUDIOOUTL
  Top 0.61: R28.1 237.49,65.79 AUDIO_OUT_L_POSTVOL.1 238.51,65.79 R30.1
  Bottom 0.813: AUDIO_OUT_L_POSTVOL.1 237.74,65.02 233.68,65.02 231.9,63.25 231.9,60.2 228.6,56.9 219.2,56.9 214.38,52.07 JP4.6
AUDIOOUTR
  Top 0.61: R29.1 AUDIO_OUT_R_POSTVOL.1 R31.1
  Bottom 0.813: AUDIO_OUT_R_POSTVOL.1 236.98,56.64 232.92,56.64 231.39,55.12 S1.2 S1.5
AUDIOOUTR_PRESWITCH
  Bottom 0.813: S1.6 S1.3 227.24,55.37 220.47,55.37 216.92,51.82 JP4.8
BLUE_LED
  Top 0.203: U4.63 83.33,76.13
  Top 0.254: 83.33,76.13 R54.2
BYPASS
  Top 0.406: U2.4 163.13,63.75
  Top 0.61: C2.1 163.13,64.08 163.13,63.75
CAP_0_0
  Top 0.203: 94.23,81.53 88.18,75.48 64.96,75.48 64.71,75.73 U4.62
  Top 0.305: ST1.1 19.81,99.31
  Top 0.61: 94.23,81.53 94.23,95.5 90.42,99.31 19.81,99.31 R11.1
CAP_0_1
  Top 0.203: 92.46,89.92 79.1,76.56 55.48,76.56 55.47,76.55 54.57,76.55 U4.64
  Top 0.61: 92.46,89.92 92.46,95.25 89.66,98.04 18.05,98.04 17.17,97.12 16.83,96.77 ST2.1 R12.1
CAP_0_2
  Top 0.203: U4.66 63.45,77.33 64.25,78.13 72.8,78.13 81.53,86.87
  Top 0.61: 81.53,86.87 81.53,95.25 80.01,96.77 18.8,96.77 ST3.1 16,93.98 R15.1
CAP_0_3
  Top 0.203: 72.14,92.03 72.14,86.61 65.53,80.01 54.83,80.01 U4.1
  Top 0.61: 72.14,92.03 68.67,95.5 20.32,95.5 16.26,91.44 | 16.26,91.44 13.55,91.44 R16.1 | ST4.1 16.26,91.44
CAP_1_0
  Top 0.203: U4.29 44.01,73.73 39.88,69.34 39.12,68.58 39.12,67.56 37.08,65.53 CP1.1
  Top 0.61: CP1.1 R22.2
CAP_1_1
  Top 0.203: U4.32 45.61,72.53 39.62,66.55 CP2.1
  Top 0.61: R20.2 CP2.1
CAP_1_2
  Top 0.203: CP3.1 42.73,61.79 42.73,67.92 U4.34
  Top 0.305: 42.42,58.76 R18.2
  Top 0.61: R18.2 CP3.1 | CP3.1
CAP_1_3
  Top 0.203: U4.37 48.15,70.17 45.86,67.88 45.86,59.66 R17.2
  Top 0.61: R17.2 CP4.1
CLK  (via drill 0.35)
  Top 0.305: R5.2 211.42,91.95 211.42,92.04 217.68,98.3 217.68,107.7 219.46,109.47 230.89,109.47 v232.16,108.2 | v240.54,109.22 240.63,109.13 J1.5
  Bottom 0.305: v232.16,108.2 232.92,108.97 240.28,108.97 v240.54,109.22
CMD  (via drill 0.35)
  Top 0.305: v232.16,109.73 231.9,109.98 231.9,110.06 218.6,110.06 216.24,107.7 216.24,99.06 211.67,94.49 R3.2 | J1.3 238.51,106.23 238.51,109.22 237.49,110.24 v237.24,110.24
  Bottom 0.305: v237.24,110.24 236.73,109.73 v232.16,109.73
CMOD_CH0
  Top 0.203: U4.60 61.35,74.93 C29.1
CMOD_CH1
  Top 0.203: U4.15 48.16,78.95 48.16,80.02 46.84,81.34 C61.1
CV_PEDAL  (via drill 0.35)
  Top 0.203: U4.33 45.97,72.13 41.91,68.07 v41.91,63.5
  Top 0.406: 207.52,42.67 206.76,43.43 206.47,45.43 v205.71,46.19
  Top 0.61: v225.55,42.67 207.52,42.67
  Bottom 0.406: CV_PEDAL.1 159.77,59.44 161.54,58.67 174.3,57.98 203.45,48.26 205.57,46.68 v205.71,46.19 v205.71,46.2 205.74,46.23
  Bottom 0.508: v41.91,63.5 42.42,62.99 45.47,62.99 49.28,59.18 108.2,59.18 112.01,62.99 CV_PEDAL.1
  Bottom 0.61: JP1.5 250.7,52.07 248.41,52.07 247.65,51.31 247.65,48.77 242.32,43.43 233.43,43.43 232.92,43.94 226.82,43.94 v225.55,42.67
CV_PEDAL_SENSE  (via drill 0.35)
  Top 0.203: U4.31 45.24,72.93 38.61,66.29 v38.61,65.28
  Top 0.406: v207.26,45.97 207.52,45.72 208.28,44.2
  Top 0.61: R103.2 226.06,45.47 224.79,44.2 208.28,44.2
  Bottom 0.203: v38.61,65.28 39.37,66.04 43.94,66.04 44.45,65.53 62.23,65.53 65.02,62.74 107.95,62.74 110.24,65.02 113.03,65.02 113.28,64.77 113.41,64.9
  Bottom 0.406: 113.41,64.9 119.89,64.01 159.77,60.71 162.31,61.21 163.58,60.96 164.85,59.94 171.7,58.93 176.78,58.93 187.71,55.37 188.72,56.13 190.25,56.13 191.01,55.12 191.52,54.1 197.76,52.02 203.96,49.28 206.25,47.5 v207.26,45.97
DAT0  (via drill 0.35)
  Top 0.305: R6.2 212.09,97.03 215.39,100.33 215.39,108.97 v215.9,109.47 | v242.82,109.73 v242.83,109.73 J1.7
  Bottom 0.305: v215.9,109.47 216.15,109.47 217.93,111.25 241.3,111.25 v242.82,109.73
DAT1  (via drill 0.35)
  Top 0.305: R7.2 211.84,99.57 213.87,101.6 213.87,108.71 v214.63,109.47 | v245.24,110.11 245.24,108.98 243.93,107.67 J1.8
  Bottom 0.305: v214.63,109.47 217.17,112.01 243.59,112.01 245.36,110.24 v245.24,110.11
DAT2
  Top 0.305: R9.2 212.69,104.39 212.69,109.28 214.12,110.72 233.94,110.72 236.23,108.43 J1.1
DAT3
  Top 0.305: R2.2 210.4,108.29 213.36,111.25 234.51,111.25 237.33,108.43 J1.2
DGND  (via drill 0.35, 0.6)
  Top 0.203: C43.2 58.51,70.13 | C46.2 58.51,69.25 58.67,69.09 59.01,69.09 | 51.35,77.18 51.56,76.96 52.15,77.55 U4.5 52.15,79.68 51.82,80.01 v51.05,80.01 | U4.45 51.35,72.17 | 51.35,72.17 51.56,72.39 | 52.62,74.13 U4.58 59.92,74.13 60.05,74.01 60.05,73.9 60.54,73.41 64.01,73.41 | 52.62,74.13 52.58,74.17 | JP5.3 JP5.5 JP5.7 JP5.9 | JP8.1 JP8.2 | U6.2 27.94,82.8 | 27.94,82.8 27.09,82.8 R55.2 | 27.94,82.8 27.94,82.3 | 27.94,82.3 U6.3 | C50.2 32.62,83.71 v32.77,83.57 | v32.26,80.26 C54.2 30.48,80.63 30.48,81.63 U6.7 U6.6 | C36.2 64.01,72.48 | 64.01,74.03 C29.2 | 64.1,70.95 v64.01,70.87 | 27.94,82.3 27.69,82.04 27.43,82.04 v27.18,81.79 | 50.8,74.13 50.08,74.13 48.88,75.33 U4.25 43.03,75.33 42.42,75.95 40.64,75.95 40.02,75.32 C40.2 40.02,74.14 v39.57,73.7 | 50.8,74.13 51.05,74.13 | 51.05,74.13 51.35,74.13 | 51.35,74.13 52.62,74.13 | U4.7 51.35,77.18 | 51.35,77.18 50.95,77.58 U4.8 50.95,77.62 50.55,77.22 U4.9 U4.69 | U4.69 50.8,74.68 50.8,74.13 | U4.69 51.05,74.42 51.05,74.13 | U4.69 51.35,74.13 | 51.35,74.13 51.35,72.17
  Top 0.254: 58.51,69.25 58.51,70.13 | v59.61,68.5 59.01,69.09 | 64.01,72.48 64.01,73.41 64.01,74.03 | C36.2 64.1,70.95 | JP9.1 JP9.2 68.33,85.09 v66.55,83.31 | JP8.1 37.81,91.66 v38.73,92.58
  Top 0.305: LED1.C 87.62,78.99 v88.14,78.99 | C45.2 40.16,83.42 41.15,83.42 | 41.15,83.42 C44.2 | 41.15,83.42 41.15,83.57 41.06,83.65 v41.06,84.41 | C61.2 46.84,84.94 46.99,85.09 v46.99,85.7 | JP23.2 29.61,71.26 | 29.61,71.26 30.73,70.14 v30.73,70.1 | JP23.1 33.38,71.26 29.61,71.26 | JP5.9 44.67,93.47 44.45,93.47 v44.45,93.62
  Top 0.508: IC2.13 v32.13,54.89 32.13,55.15 30.12,57.16 v29.98,57.16 | IC2.8 37.21,48.39 v37.85,49.02 | v229.62,39.12 C27.2 234.69,39.12 R14.1 | J1.6 241.73,108.38 241.81,108.46 v241.81,108.71 | 245.1,102.36 v246.38,102.36 | 234.45,102.36 v233.17,102.36
  Top 0.61: 234.45,102.36 J1.10 J1.11 | J1.13 245.1,102.36 J1.12 | U5.15 223.9,29.08 223.41,29.58 C26.2 v222.76,30.99 | U5.9 225.55,36.79 v225.55,38.1 | R8.2 250.36,32.77 v252.22,32.77
  Top 1.016: 264.67,56.13 264.16,56.64 | R50.1 258.66,48.01 JP1.10
  Top 1.27: C70.- 253.24,30.48 252.22,31.5 v252.22,32.77
  Top 2.54: C66.- 264.67,56.13 | 264.16,56.64 v263.65,56.64
  Route2 0.305: v88.14,78.99 87.63,78.99
  Route2 1.016: v38.73,92.58 39.12,92.96
  Bottom 0.508: v29.98,57.16 30.23,57.4 | v37.85,49.02 37.85,49.28 36.58,50.55 33.53,50.55 32,52.07 32,54.86 32.03,54.89 v32.13,54.89
  Bottom 0.61: 30.23,57.4 31.24,58.42 v31.24,67.56
  pour Route2 (isolate 0.508, rank 2): 97.52,100.18 97.32,81.28 78.23,81.28 78.23,81.53 76.45,83.31 70.01,87.82 69.9,90.05 65.68,94.23 24.54,93.33 24.19,83.08 29.08,76.1 28.62,66.02 89.92,67.31 101.6,67.06 108.71,71.66 109.58,76.96 115.74,83.57 146.36,83.57 147.12,84.02 149.1,82.04 159.26,71.37 166.37,71.14 166.1,85.59 169.66,87.37 184.42,87.56 194.82,86.87 198.88,82.8 199.39,81.53 200.75,76.49 209.85,76.77 209.84,77.16 216.41,84.07 227.33,84.07 234.95,93.22 247.18,93.22 260.33,80.89 260.69,58.76 260.6,48.26 254.25,48.26 253.94,47.32 251.55,45.23 246.31,45.14 243.01,41.84 231.1,41.84 228.09,41.91 228.09,39.62 227.84,39.37 207.26,39.37 207.01,39.12 220.73,25.4 228.09,25.33 261.03,25.33 271.53,34.29 271.53,109.14 267.1,113.95 198.12,113.54 173.48,106.17 147.57,102.62 112.27,101.35 111.1,100.18
DGND3
  Top 1.27: JP15.10 JP15.12
  pour Route15 (isolate 0.762, rank 2): 154.69,40.13 163.94,40.13 173.34,32.82 188.56,30.65 201.84,23.51 204.72,18.71 204.72,6.11 190.5,6.36 190.72,22.86 178,22.86 164.67,28.22 161.96,31.2 154.69,31.24
DM  (via drill 0.35)
  Top 0.508: 249.68,42.93 JP1.13
  Top 0.61: 249.68,42.93 248.16,41.4 248.16,39.12 246.63,37.59 JP22.2 | v241.3,33.78 239.86,33.78 R37.2
  Bottom 0.61: JP22.2 242.82,37.59 241.81,36.58 241.81,34.29 v241.3,33.78
DOWN  (via drill 0.35)
  Top 0.203: U4.41 49.76,70.91 49.76,68.74 50.04,68.47 50.04,67.65 49.55,67.16 49,67.16 48.6,67.56 47.75,67.56 47.93,67.74 v48.01,67.74 | v68.33,68.07 v68.33,72.9 | v56.9,84.07 60.2,87.38 60.96,87.38 v60.96,87.63 | v65.28,83.06 66.04,82.3 66.55,82.3 69.85,85.6 69.85,92.46 69.09,93.22 67.56,93.22 67.06,92.71 JP9.3
  Bottom 0.203: v48.01,67.74 48.34,67.74 48.77,67.31 49.78,67.31 51.05,68.58 52.32,68.58 54.99,65.91 62.87,65.91 65.56,63.22 66.98,63.22 67,63.25 67.56,63.25 68.07,63.75 68.07,67.56 68.33,67.82 v68.33,68.07 | v68.33,72.9 66.95,74.27 66.7,74.57 60.96,80.52 57.66,83.82 57.15,83.82 v56.9,84.07 | v60.96,87.63 65.28,83.31 v65.28,83.06
DP
  Top 0.61: 250.95,40.39 250.19,39.62 250.19,37.08 248.16,35.05 JP22.3 244.35,34.8 242.06,34.8 240.54,36.32 R41.2
  Top 1.016: 250.95,40.39 JP1.15
EGND  (via drill 0.35)
  Top 0.254: C3.2 305.31,84.84 305.18,84.96 v305.18,85.72
  Top 0.406: IC18.28 300.23,95.09 300.23,96.1 C86.2
  Top 0.61: JP34.7 JP34.9 310.1,93.22 309.37,92.49 v309.37,91.19 309.85,90.71 309.85,90.68 JP34.5 311.4,90.65 311.4,89.44 JP34.3 | v306.71,97.92 306.83,98.04 306.74,98.13 C87.2 C85.2 300.4,98.13 C86.2 | JP6.1 JP6.2 | D4.C 287.04,103.86 287.02,103.89 286.51,103.89 v286.26,103.63 | D5.C 290.85,98.28 291.34,97.79 v291.47,97.92 | D6.C 286.53,92.69 286.05,93.18 286.05,93.25 285.75,93.55 285.75,94.23 v285.24,94.74 | D7.C 286.53,87.1 285.5,88.13 v285.5,88.38 | D8.C 286.03,81.51 v285.5,82.04 | D10.C 288.31,75.69 v286.51,75.69 | D11.C 288.06,69.85 286.51,69.85 v286.26,70.1 | D12.C 288.06,64.26 286.51,64.26 v286.26,64.52
  Top 0.813: v290.58,55.12 JP6.1
  pour Route2: 314.96,116.84 314.96,54.86 313.18,53.09 281.94,53.09 280.42,54.61 280.42,115.32 281.69,116.59 314.71,116.59
ELECTROSTEEL_GND  (5 unrouted)
ELECTROSTEELHIGH  (1 unrouted)
ENTER  (via drill 0.35)
  Top 0.203: U4.40 49.35,68.14 v49.28,68.07 | v67.06,67.82 67.06,73.15 v66.55,73.15 | v57.66,82.8 61.98,87.12 61.98,88.14 62.99,89.15 64.26,89.15 64.52,88.9 JP9.8
  Bottom 0.203: v49.28,68.07 51.05,69.85 52.07,69.85 55.63,66.29 63.59,66.29 66.28,63.6 66.82,63.6 67.21,63.99 67.21,64.53 67.06,64.68 v67.06,67.82 | v57.66,82.8 60.35,80.11 60.35,79.35 v66.55,73.15
EXT_MUX_EN  (via drill 0.35)
  Top 0.203: U4.61 59.82,75.33 59.83,75.31 64.39,75.31 65.28,74.42 65.28,54.86 v64.77,54.36
  Top 0.406: v34.67,45.09 IC2.6
  Bottom 0.406: v64.77,54.36 54.86,44.45 35.31,44.45 v34.67,45.09
EXT_MUX_S0  (via drill 0.35)
  Top 0.203: U4.27 43.58,74.53 43.56,74.55 43.05,74.55 36.83,68.33 36.83,67.31 v36.58,67.06
  Top 0.61: IC2.10 35.94,54.74 36.58,55.37 v36.58,55.63
  Bottom 0.203: v36.58,55.63 34.29,57.91 34.29,64.77 v36.58,67.06
EXT_MUX_S1  (via drill 0.35)
  Top 0.203: U4.28 43.65,74.13 37.85,68.33 v37.85,67.82
  Top 0.61: IC2.9 37.21,53.98 38.35,55.12 v38.35,55.37
  Bottom 0.203: v37.85,67.82 37.85,67.06 35.05,64.26 35.05,58.67 v38.35,55.37
FR_3V3  (via drill 0.6)  (1 unrouted)
  Top 0.406: JP24.5 JP24.6 285.28,12.2 287.21,12.2 v287.28,12.12
  pour Route15: 297.69,16 297.69,0.25 271.02,0.25 271.02,16
FR_GND  (via drill 0.6)  (1 unrouted)
  Top 0.406: JP24.1 JP24.2 | v282.19,15.25 282.18,15.24 R137.2
  Top 0.61: v284.48,7.87 284.48,8.86 JP24.2
  pour Route2: 297.69,16.51 297.69,0.25 271.02,0.25 271.02,16 297.18,16
GNDINT  (via drill 0.35)
  Top 0.406: U10.11 212.85,60.71 213.36,60.2 v213.87,60.2
  Top 0.61: R89.1 204.47,55.37 R90.1
  Top 0.813: R57.1 v217.17,59.18 | 204.47,55.37 204.72,55.12 204.72,54.1 v204.98,53.85 | R56.1 198.03,69.85 v199.14,69.85 | v212.85,73.66 212.85,73.91 v212.22,74.55 211.67,74 R35.2 | R34.2 214.03,74 v213.61,74.42 v212.85,73.66 | v212.85,73.66 C28.2
  Top 1.016: R32.1 U$9.P$4 231.39,78.99 | C20.2 230.4,78.99 231.39,78.99 | 231.39,78.99 231.14,78.74 v228.85,78.74
  pour Route2 (isolate 0.61, rank 2): 199.39,72.39 195.58,68.58 195.58,56.13 198.12,53.59 203.45,53.59 204.98,52.07 204.98,51.31 207.52,48.77 221.23,48.77 222,49.53 234.7,49.53 234.95,49.28 235.71,50.04 235.71,53.34 239.78,57.4 249.17,57.4 251.46,55.12 253.49,55.12 253.24,54.86 257.3,54.86 257.3,65.53 249.17,73.66 239.52,73.66 234.19,78.99 234.19,83.06 231.39,83.06 230.89,82.55 217.17,82.55 209.8,75.18 199.64,75.18 199.39,74.93
GNDINT_KNOBS
  pour Route2 (isolate 0.762): 37.11,116.87 37.85,117.6 37.85,129.03 2.29,129.03 2.03,128.78 2.03,112.01 2.54,111.51 17.27,111.51 22.63,116.87
  pour Route15 (isolate 0.762): 38.61,128.27 38.61,117.6 37.85,116.84 21.08,116.84 21.08,111.51 2.54,111.51 1.52,112.52 1.52,127.76 3.3,129.54 37.34,129.54
GNDIO
  Top 0.61: C30.2 237.35,29.58 236.85,29.08 U5.2 233.3,29.08 230.89,31.5 230.89,33.78 233.81,36.7 U5.8
  Top 1.016: JP22.4 243.08,32.51 240.14,29.58 C30.2
  Bottom 1.016: JP22.4 247.65,32.51 247.9,32.77 247.9,33.02 249.94,35.05 253.75,35.05 257.05,38.35 257.05,49.53 256.03,50.55 JP1.8
IDAC_OUT
  Top 0.203: 51.73,38.27 63.25,49.78 63.25,69.34 59.26,73.32 56.58,73.32 56.58,73.33 U4.56
  Top 0.813: R10.1 51.73,38.27
JOY_X
  Top 0.203: U4.68 55.82,79.4 56.74,79.4 58.17,77.98 62.74,77.98 63.5,78.74 69.34,78.74 76.77,86.17 JP13.2
  Top 0.61: C58.1 75.3,91.83 76.45,90.68 76.45,89.85 JP13.2
JOY_Y
  Top 0.203: U4.65 55.32,76.93 55.32,76.94 77.95,76.94 86.68,85.66 JP12.2
  Top 0.61: C57.1 85.97,92.34 86.68,91.63 JP12.2
KNOB1_HIGH